# EAGLE design TTN-Node-v7-01 (EAGLE 9.4.2)

## Sheet 1 of 2
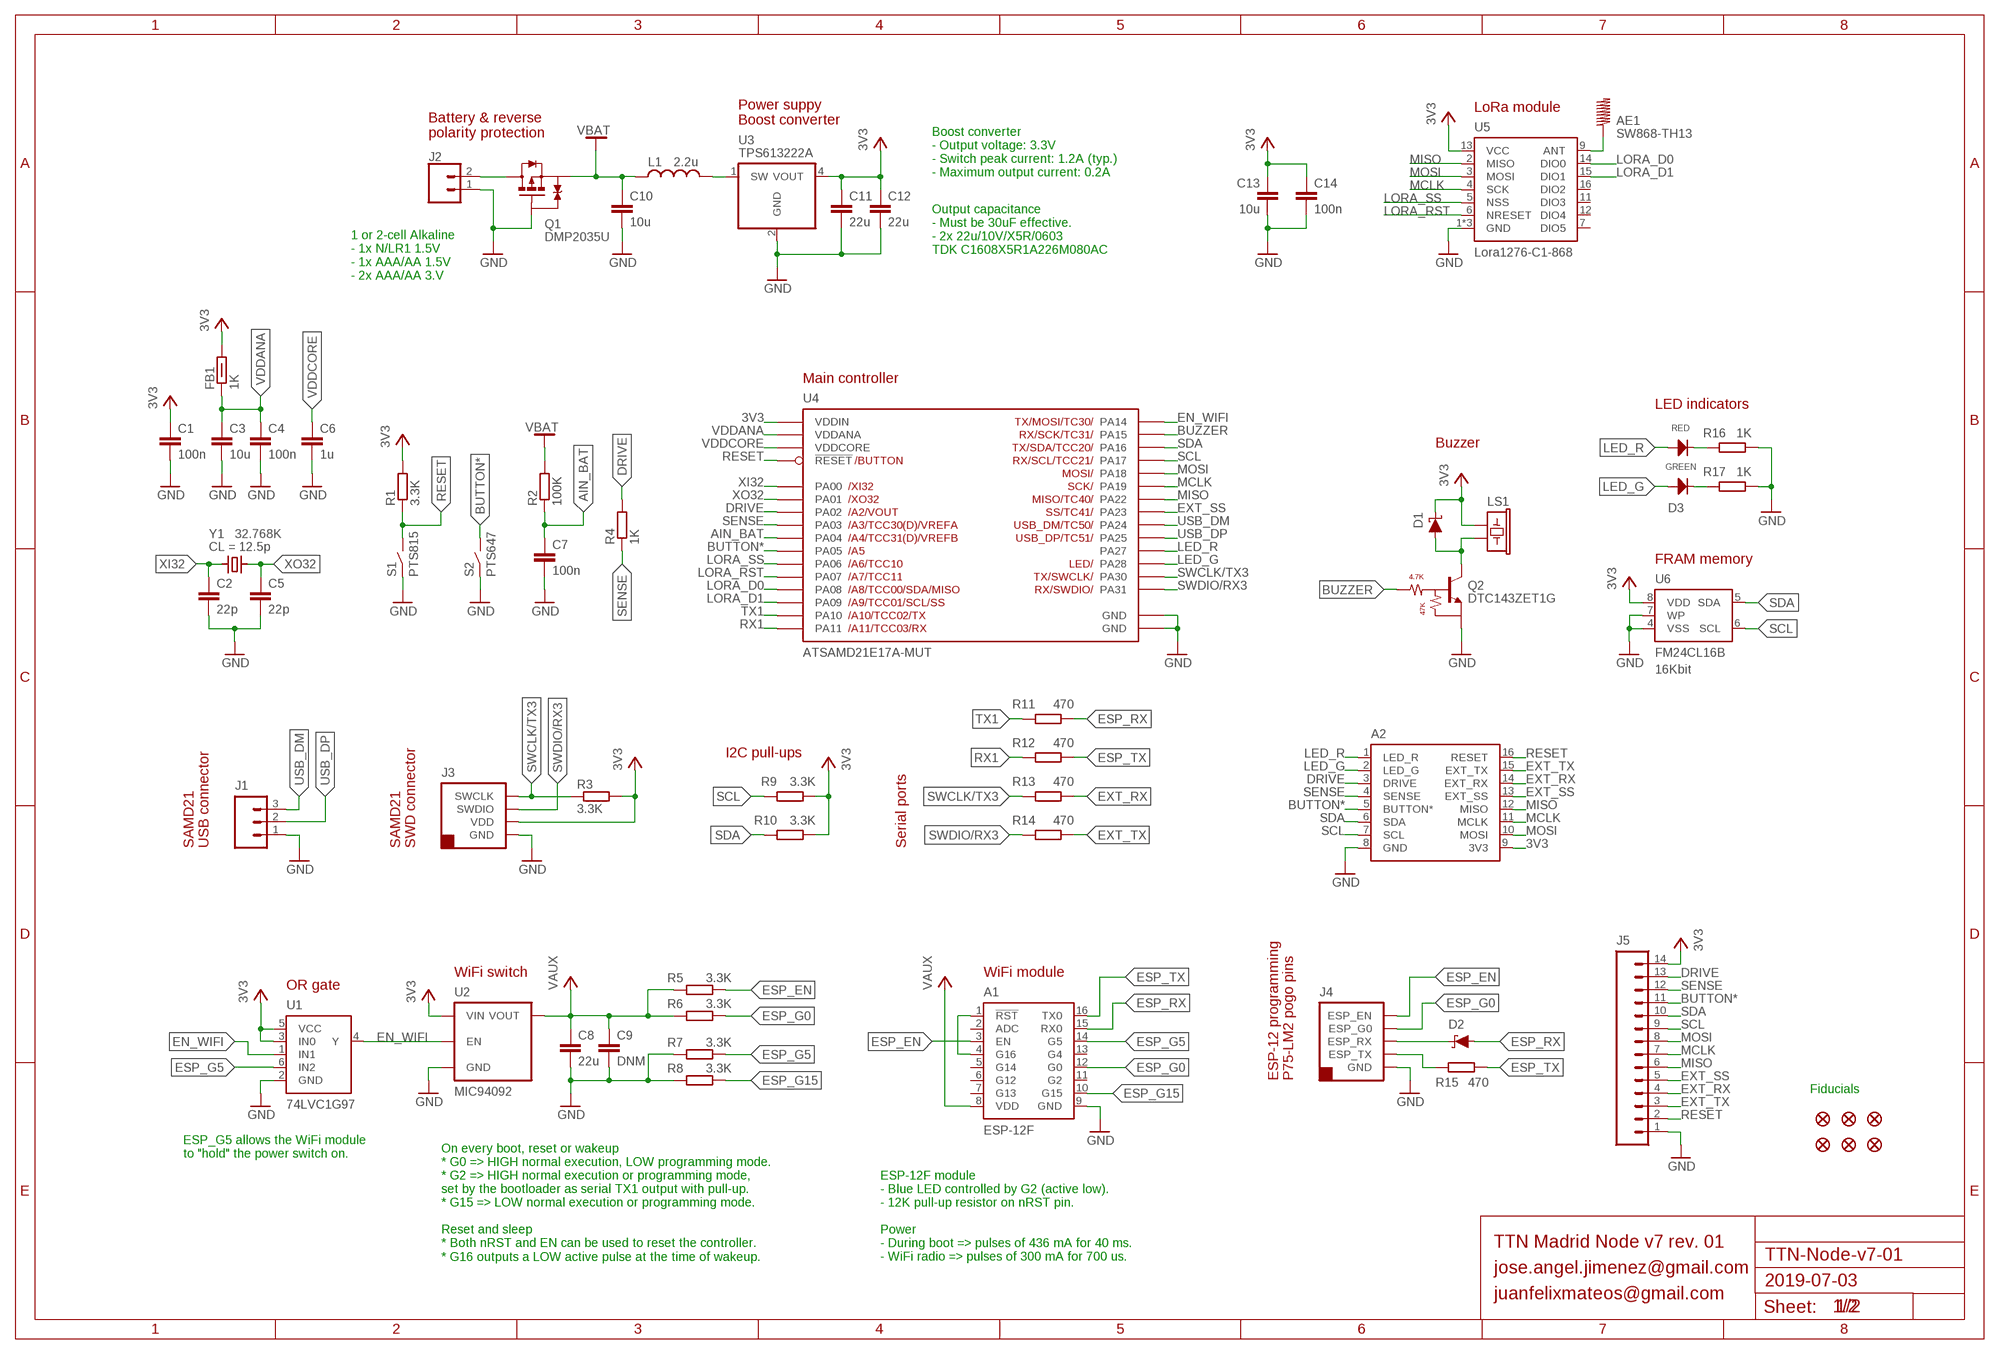
[diagram p0: schematic, sheet 1]

### Parts
A1  ESP-12F  [ESP-12]
A2  TTN_MAD_NODE_V7_EXP  [TTN_MAD_NODE_V7_EXP]
AE1  SW868-TH13  ANT-SW868-TH13  [ANT-SW868-TH13]
C1  100n  CAPACITOR_0603  [C0603]
C2  22p  CAPACITOR_0603  [C0603]
C3  10u  CAPACITOR_0603  [C0603]
C4  100n  CAPACITOR_0603  [C0603]
C5  22p  CAPACITOR_0603  [C0603]
C6  1u  CAPACITOR_0603  [C0603]
C7  100n  CAPACITOR_0603  [C0603]
C8  22u  CAPACITOR_0603  [C0603]
C9  DNM  CAPACITOR_0603  [C0603]
C10  10u  CAPACITOR_0603  [C0603]
C11  22u  CAPACITOR_0603  [C0603]
C12  22u  CAPACITOR_0603  [C0603]
C13  10u  CAPACITOR_0603  [C0603]
C14  100n  CAPACITOR_0603  [C0603]
D1  RB521S30  DIODE-SCHOTTKY-RB521S30T1G  [SOD523]
D2  RB521S30  DIODE-SCHOTTKY-RB521S30T1G  [SOD523]
D3  LTST-E682KRKGWT  LED-RG-LTST-E682KRKGWT  [LED-PLCC-4-3522]
FB1  1K  FERRITE_BEAD_0603_1K  [L0603]
FD1  FIDUCIAL1X2  [FIDUCIAL-1X2]
FD2  FIDUCIAL1X2  [FIDUCIAL-1X2]
FD3  FIDUCIAL1X2  [FIDUCIAL-1X2]
FD4  FIDUCIAL1X2  [FIDUCIAL-1X2]
FD5  FIDUCIAL1X2  [FIDUCIAL-1X2]
FD6  FIDUCIAL1X2  [FIDUCIAL-1X2]
J1  USB  CONN_03  [1X03]
J2  CONN_02  [1X02]
J3  CON-SWD-HDR-1X4-254  [HDR-1X4-254-SWD]
J4  CON-ESP-HDR-1X5-254  [HDR-1X5-254-ESP]
J5  CONN_14  [1X14]
L1  2.2u  INDUCTOR_2520_MM  [L2520_MM]
LS1  BUZZER-SMD-4030_MM  [BUZZER-4030_MM]
Q1  DMP2035U  MOSFET-P-DMP2035U-ESD  [SOT23-3]
Q2  DTC143ZET1G  BJT-NPN-4.7K-47K  [SC75-3]
R1  3.3K  RESISTOR_0603  [R0603]
R2  100K  RESISTOR_0603  [R0603]
R3  3.3K  RESISTOR_0603  [R0603]
R4  1K  RESISTOR_0603  [R0603]
R5  3.3K  RESISTOR_0603  [R0603]
R6  3.3K  RESISTOR_0603  [R0603]
R7  3.3K  RESISTOR_0603  [R0603]
R8  3.3K  RESISTOR_0603  [R0603]
R9  3.3K  RESISTOR_0603  [R0603]
R10  3.3K  RESISTOR_0603  [R0603]
R11  470  RESISTOR_0603  [R0603]
R12  470  RESISTOR_0603  [R0603]
R13  470  RESISTOR_0603  [R0603]
R14  470  RESISTOR_0603  [R0603]
R15  470  RESISTOR_0603  [R0603]
R16  1K  RESISTOR_0603  [R0603]
R17  1K  RESISTOR_0603  [R0603]
S1  PTS815  SW-PTS810/815-PTS815  [SW-SMD-PTS815-4232]
S2  PTS647  SW-PTS647-2.5N-5.0MM  [SW-SMD-PTS647-4545]
U1  74LVC1G97  LOGIC-1G97DCKR  [SC70-6]
U2  MIC94092  MIC94092YC6-TR  [SOT363]
U3  TPS613222A  VREG-TPS613222ADBVR  [SOT23-5]
U4  ATSAMD21E17A-MUT  SAMD21E_A/B/C/D-QFN32L  [VQFN32L-05-5050_MM-SEGMENTED]
U5  Lora1276-C1-868  LORA-RFM95W-LORA1276-C1-868  [RFM95W]
U6  FM24CL16B  MEMORY-I2C-WP-FM24CL16B-G  [SO8]
Y1  32.768K  CRYSTAL-3215  [CRYSTAL-3215]

### Nets
3V3 [supply]: A2.9(3V3) C1.P$1 C11.P$1 C12.P$1 C13.P$1 C14.P$1 D1.C FB1.P$2 J3.2(VDD) J5.14 LS1.1 R1.P$2 R3.P$2 R9.P$2 R10.P$2 U1.3(IN0) U1.5(VCC) U2.4(VIN) U3.4(VOUT) U4.30(VDDIN) U5.13(VCC) U6.8(VDD) ; also sheet 2
*ESP_RST: A1.1(!RST) A1.4(G16)
AIN_BAT: C7.P$1 R2.P$1 U4.5(PA04)
ANT [supply]: AE1.ANT U5.9(ANT)
BOOST_SW [supply]: L1.2 U3.1(SW)
BUTTON*: A2.5(BUTTON*) J5.11 S2.3 S2.4 U4.6(PA05)
BUZZER: Q2.1(B) U4.16(PA15)
CG: D3.3(C_GREEN) R17.P$1
CR: D3.1(C_RED) R16.P$1
DRIVE: A2.3(DRIVE) J5.13 R4.P$2 U4.3(PA02)
EN_WIFI: U1.1(IN1) U1.4(Y) U2.6(EN) U4.15(PA14)
ESP_EN: A1.3(EN) J4.5(ESP_EN) R5.P$2
ESP_G0: A1.12(G0) J4.4(ESP_G0) R6.P$2
ESP_G5: A1.14(G5) R7.P$2 U1.6(IN2)
ESP_G15: A1.10(G15) R8.P$2
ESP_RX: A1.15(RX0) D2.A R11.P$2
ESP_RX_CON: D2.C J4.3(ESP_RX)
ESP_TX: A1.16(TX0) R12.P$2 R15.P$2
ESP_TX_CON: J4.2(ESP_TX) R15.P$1
EXT_RX: A2.14(EXT_RX) J5.4 R13.P$2
EXT_SS: A2.13(EXT_SS) J5.5 U4.22(PA23)
EXT_TX: A2.15(EXT_TX) J5.3 R14.P$2
GND [supply]: A1.9(GND) A2.8(GND) C1.P$2 C2.P$2 C3.P$2 C4.P$2 C5.P$2 C6.P$2 C7.P$2 C8.P$2 C9.P$2 C10.P$2 C11.P$2 C12.P$2 C13.P$2 C14.P$2 J1.1 J2.1 J3.1(GND) J4.1(GND) J5.1 Q1.1(G) Q2.2(E) R7.P$1 R8.P$1 R16.P$2 R17.P$2 S1.1 S1.2 S2.1 S2.2 U1.2(GND) U2.2(GND) U2.5(GND) U3.2(GND) U4.10(GND) U4.28(GND) U4.33(GND) U5.1(GND) U5.8(GND) U5.10(GND) U6.4(VSS) U6.7(WP) ; also sheet 2
LED_G: A2.2(LED_G) D3.2(A_GREEN) U4.27(PA28)
LED_R: A2.1(LED_R) D3.4(A_RED) U4.25(PA27)
LORA_D0: U4.11(PA08) U5.14(DIO0)
LORA_D1: U4.12(PA09) U5.15(DIO1)
LORA_RST: U4.8(PA07) U5.6(NRESET)
LORA_SS: U4.7(PA06) U5.5(NSS)
MCLK: A2.11(MCLK) J5.7 U4.20(PA19) U5.4(SCK)
MISO: A2.12(MISO) J5.6 U4.21(PA22) U5.2(MISO)
MOSI: A2.10(MOSI) J5.8 U4.19(PA18) U5.3(MOSI)
N$1: D1.A LS1.2 Q2.3(C)
RESET: A2.16(RESET) J5.2 R1.P$1 S1.3 S1.4 U4.26(!RESET)
RX1: R12.P$1 U4.14(PA11)
SCL: A2.7(SCL) J5.9 R9.P$1 U4.18(PA17) U6.6(SCL) ; also sheet 2
SDA: A2.6(SDA) J5.10 R10.P$1 U4.17(PA16) U6.5(SDA) ; also sheet 2
SENSE: A2.4(SENSE) J5.12 R4.P$1 U4.4(PA03)
SWCLK/TX3: J3.4(SWCLK) R3.P$1 R13.P$1 U4.31(PA30)
SWDIO/RX3: J3.3(SWDIO) R14.P$1 U4.32(PA31) ; also sheet 2
TX1: R11.P$1 U4.13(PA10)
USB_DM: J1.3 U4.23(PA24)
USB_DP: J1.2 U4.24(PA25)
VAUX [supply]: A1.8(VDD) C8.P$1 C9.P$1 R5.P$1 R6.P$1 U2.1(VOUT)
VBAT [supply]: C10.P$1 L1.1 Q1.2(S) R2.P$2
VDDANA [supply]: C3.P$1 C4.P$1 FB1.P$1 U4.9(VDDANA)
VDDCORE [supply]: C6.P$1 U4.29(VDDCORE)
VIN [supply]: J2.2 Q1.3(D)
XI32 [supply]: C2.P$1 U4.1(PA00) Y1.P$1
XO32 [supply]: C5.P$1 U4.2(PA01) Y1.P$2
Unconnected: A1.2(ADC) A1.5(G14) A1.6(G12) A1.7(G13) A1.11(G2) A1.13(G4) U5.7(DIO5) U5.11(DIO3) U5.12(DIO4) U5.16(DIO2)

### Notes on the sheet
- LoRa module
- Power suppy
  Boost converter
- Battery & reverse
  polarity protection
- Boost converter
  - Output voltage: 3.3V
  - Switch peak current: 1.2A (typ.)
  - Maximum output current: 0.2A
- Output capacitance
  - Must be 30uF effective.
  - 2x 22u/10V/X5R/0603
  TDK C1608X5R1A226M080AC
- 1 or 2-cell Alkaline
  - 1x N/LR1 1.5V
  - 1x AAA/AA 1.5V
  - 2x AAA/AA 3.V
- Main controller
- LED indicators
- Buzzer
- FRAM memory
- I2C pull-ups
- SAMD21
  USB connector
- SAMD21
  SWD connector
- Serial ports
- WiFi switch | WiFi module
- OR gate
- ESP-12 programming
  P75-LM2 pogo pins
- Fiducials
- ESP_G5 allows the WiFi module
  to "hold" the power switch on.
- TTN Madrid Node v7 rev. 01
- On every boot, reset or wakeup
  * G0 => HIGH normal execution, LOW programming mode.
  * G2 => HIGH normal execution or programming mode,
  set by the bootloader as serial TX1 output with pull-up.
  * G15 => LOW normal execution or programming mode.
  
  Reset and sleep
  * Both nRST and EN can be used to reset the controller.
  * G16 outputs a LOW active pulse at the time of wakeup.
- ESP-12F module
  - Blue LED controlled by G2 (active low).
  - 12K pull-up resistor on nRST pin.
  
  Power
  - During boot => pulses of 436 mA for 40 ms.
  - WiFi radio => pulses of 300 mA for 700 us.
- jose.angel.jimenez@gmail.com
- 2019-07-03
- juanfelixmateos@gmail.com
- 1/2

## Sheet 2 of 2
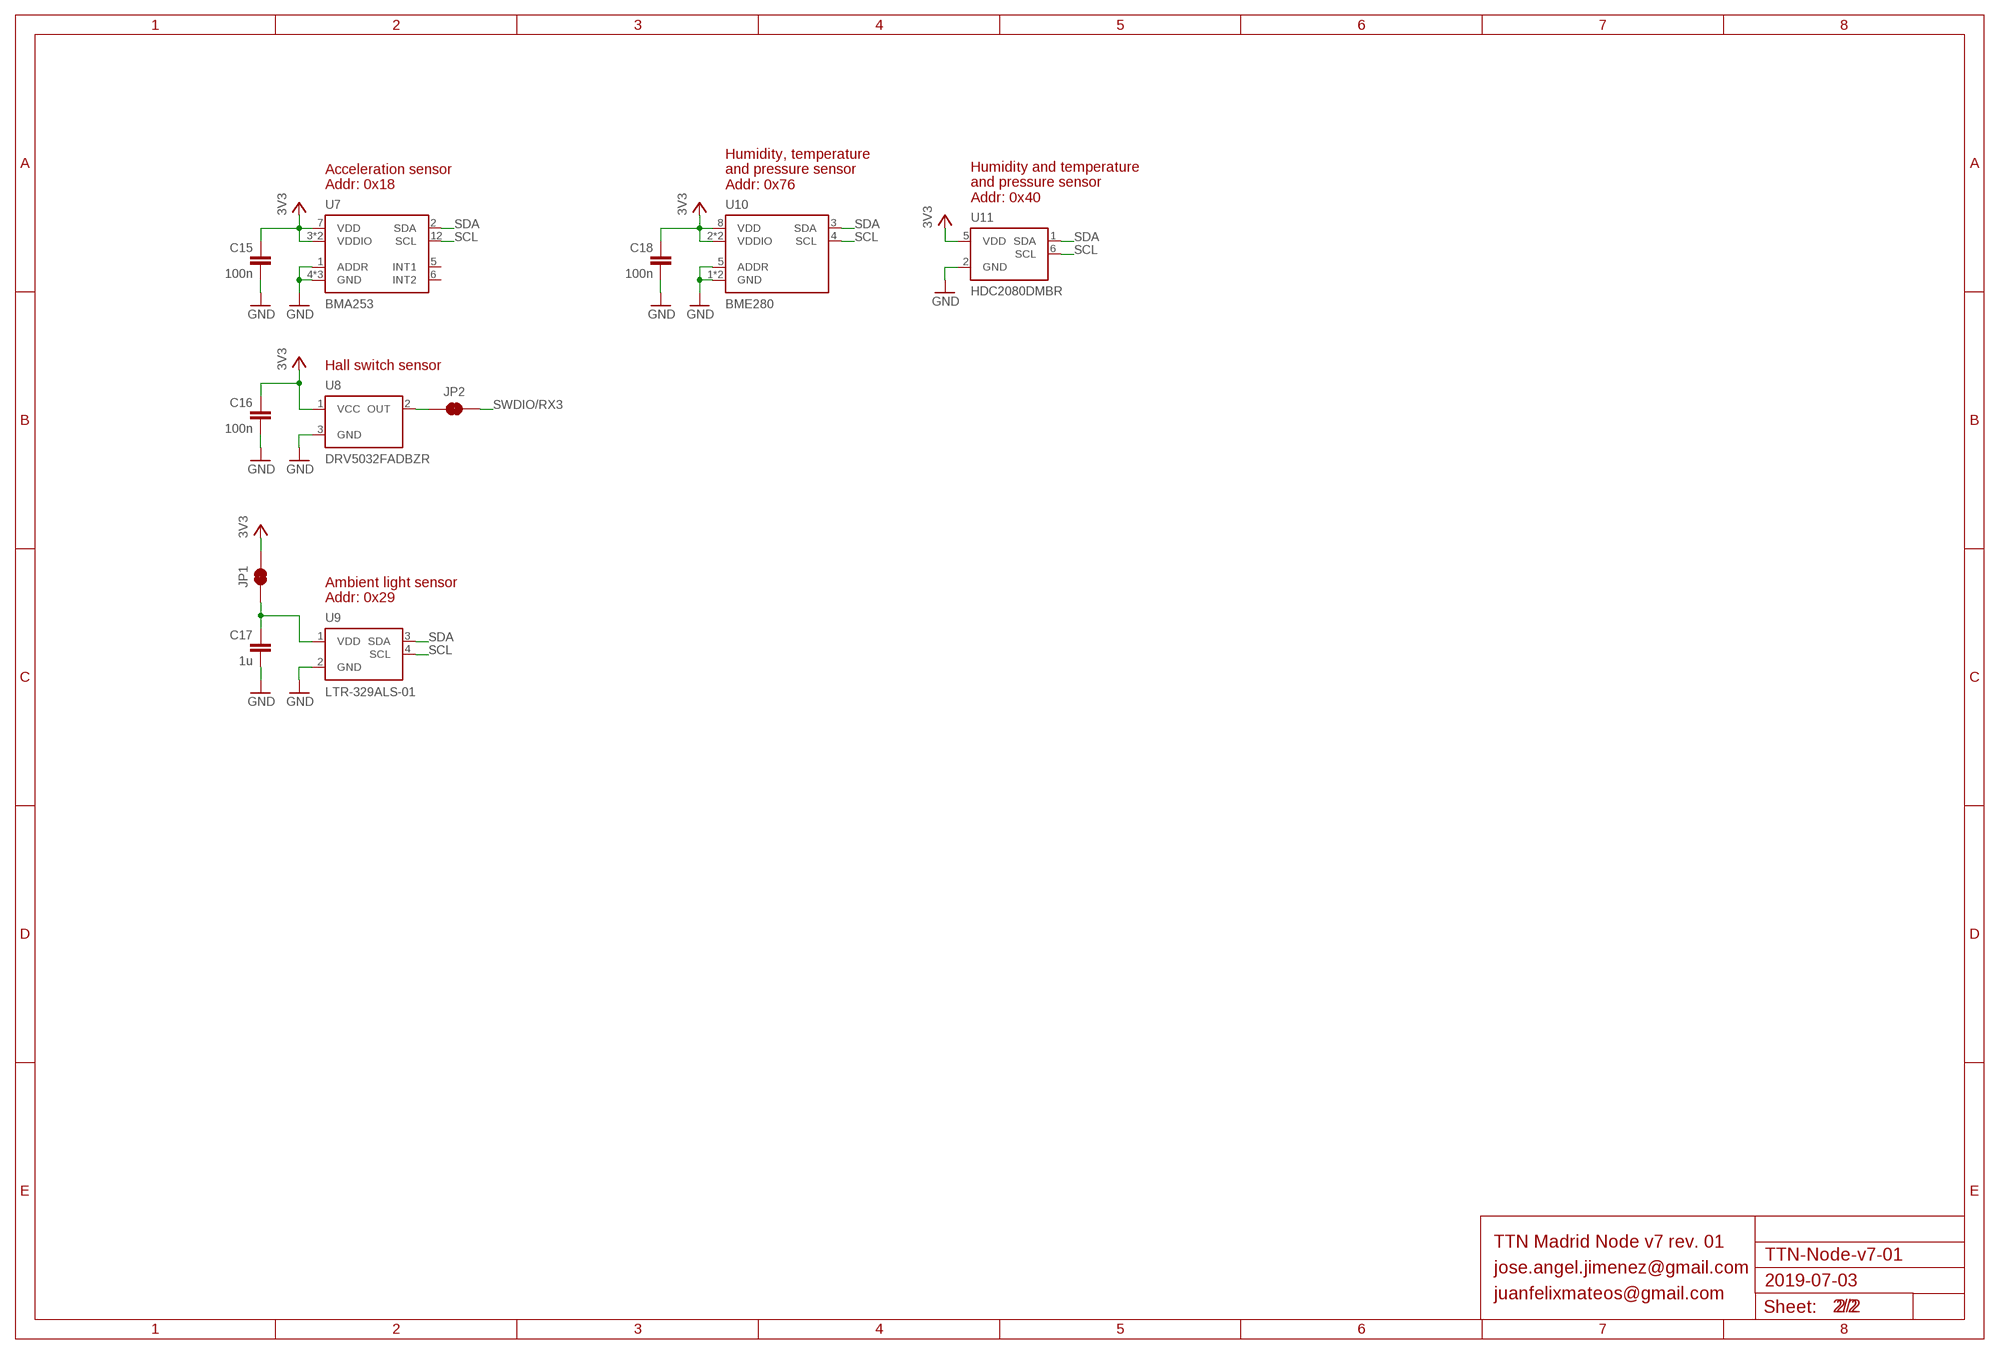
[diagram p1: schematic, sheet 2]

### Parts
C15  100n  CAPACITOR_0603  [C0603]
C16  100n  CAPACITOR_0603  [C0603]
C17  1u  CAPACITOR_0603  [C0603]
C18  100n  CAPACITOR_0603  [C0603]
JP1  JUMPER-SMT_2_NC_TRACE-OUTLINE  [SMT-JUMPER_2_NC_TRACE_OUTLINE]
JP2  JUMPER-SMT_2_NC_TRACE-OUTLINE  [SMT-JUMPER_2_NC_TRACE_OUTLINE]
U7  BMA253  SENSOR-BMA253-I2C  [LGA12]
U8  DRV5032FADBZR  SENSOR-DRV5032  [SOT23-3]
U9  LTR-329ALS-01  SENSOR-LTR-329ALS-01  [CHIPLED-PLCC4-2020MM]
U10  BME280  SENSOR-BME280-I2C  [BME280]
U11  HDC2080DMBR  SENSOR-HDC1080  [WSON-6-NOPAD]

### Nets
3V3 [supply]: C15.P$1 C16.P$1 C18.P$1 JP1.2 U7.3(VDDIO) U7.7(VDD) U7.11(VDDIO) U8.1(VCC) U10.2(VDDIO) U10.6(VDDIO) U10.8(VDD) U11.5(VDD) ; also sheet 1
GND [supply]: C15.P$2 C16.P$2 C17.P$2 C18.P$2 U7.1(ADDR) U7.4(GND) U7.8(GND) U7.9(GND) U8.3(GND) U9.2(GND) U10.1(GND) U10.5(ADDR) U10.7(GND) U11.2(GND) ; also sheet 1
LTR_3V3 [supply]: C17.P$1 JP1.1 U9.1(VDD)
N$2: JP2.1 U8.2(OUT)
SCL: U7.12(SCL) U9.4(SCL) U10.4(SCL) U11.6(SCL) ; also sheet 1
SDA: U7.2(SDA) U9.3(SDA) U10.3(SDA) U11.1(SDA) ; also sheet 1
SWDIO/RX3: JP2.2 ; also sheet 1
Unconnected: U7.5(INT1) U7.6(INT2)

### Notes on the sheet
- Acceleration sensor
  Addr: 0x18
- Humidity, temperature
  and pressure sensor
  Addr: 0x76
- Humidity and temperature
  and pressure sensor
  Addr: 0x40
- Hall switch sensor
- Ambient light sensor
  Addr: 0x29
- TTN Madrid Node v7 rev. 01
- jose.angel.jimenez@gmail.com
- 2019-07-03
- juanfelixmateos@gmail.com
- 2/2

## Library data of the parts
A1 = Anneo-Eagle:ESP-12: ESP-12 WiFi module, based on the ESP8266
A2 = Anneo-Connectors:TTN_MAD_NODE_V7_EXP: The Things Network Madrid Node v7 - 16-Pin Expansion Connector
AE1 = Anneo-Eagle:ANT-SW868-TH13: NiceRF SW868-TH13 copper spring antenna https://www.nicerf.com/product_143_118.html; MFR: NiceRF; MPN: SW868-TH13; POPULATE: 1
C1 C4 C7 C14-C16 C18 = Anneo-Eagle:CAPACITOR: Non-Polarized Capacitor. Manufacture part number (MPN) can be added via Attributes. Check https://factory.macrofab.com/parts for the house parts list. History 2019-02-09 - JAJV - Changed symbol to EU capacitor.; DIELECTRIC: X7R; MFR: Yageo; MPN: CC0603KRX7R9BB104; POPULATE: 1; SUPPLIER1: Mouser; TOLERANCE: 10%; VOLTAGE: 50V
C2 C5 = Anneo-Eagle:CAPACITOR: Non-Polarized Capacitor. Manufacture part number (MPN) can be added via Attributes. Check https://factory.macrofab.com/parts for the house parts list. History 2019-02-09 - JAJV - Changed symbol to EU capacitor.; DIELECTRIC: C0G; MFR: AVX; MPN: 06035A220JAT2A; POPULATE: 1; SUPPLIER1: Mouser; TOLERANCE: 5%; VOLTAGE: 50V
C3 C10 C13 = Anneo-Eagle:CAPACITOR: Non-Polarized Capacitor. Manufacture part number (MPN) can be added via Attributes. Check https://factory.macrofab.com/parts for the house parts list. History 2019-02-09 - JAJV - Changed symbol to EU capacitor.; DIELECTRIC: X5R; MFR: Murata; MPN: GRM188R60J106KE47D; POPULATE: 1; SUPPLIER1: Mouser; TOLERANCE: 10%; VOLTAGE: 6.3V
C6 C17 = Anneo-Eagle:CAPACITOR: Non-Polarized Capacitor. Manufacture part number (MPN) can be added via Attributes. Check https://factory.macrofab.com/parts for the house parts list. History 2019-02-09 - JAJV - Changed symbol to EU capacitor.; DIELECTRIC: X5R; MFR: Yageo; MPN: CC0603KRX5R8BB105; POPULATE: 1; SUPPLIER1: Mouser; TOLERANCE: 10%; VOLTAGE: 25V
C8 C11 C12 = Anneo-Eagle:CAPACITOR: Non-Polarized Capacitor. Manufacture part number (MPN) can be added via Attributes. Check https://factory.macrofab.com/parts for the house parts list. History 2019-02-09 - JAJV - Changed symbol to EU capacitor.; DIELECTRIC: X5R; MFR: TDK; MPN: C1608X5R1A226M080AC; POPULATE: 1; SUPPLIER1: Mouser; TOLERANCE: 20%; VOLTAGE: 10V
C9 = Anneo-Eagle:CAPACITOR: Non-Polarized Capacitor. Manufacture part number (MPN) can be added via Attributes. Check https://factory.macrofab.com/parts for the house parts list. History 2019-02-09 - JAJV - Changed symbol to EU capacitor.; DIELECTRIC: X5R; MFR: TDK; MPN: C1608X5R1A226M080AC; POPULATE: 0; SUPPLIER1: Mouser; TOLERANCE: 20%; VOLTAGE: 10V
D1 D2 = Anneo-Eagle:DIODE-SCHOTTKY; MFR: On Semi; MPN: RB521S30T1G; PN1: 863-RB521S30T1G; POPULATE: 1; SUPPLIER1: Mouser
D3 = Anneo-Eagle:LED-RG: Dual LED; MFR: Lite-On; MPN: LTST-E682KRKGWT; PN1: 859-LTST-E682KRKGWT; POPULATE: 1; SUPPLIER1: Mouser
FB1 = Anneo-Eagle:FERRITE_BEAD: Ferrite chip bead; MFR: TDK; MPN: MPZ1608S102ATA00; PN1: 810-MPZ1608S102ATA00; POPULATE: 1; SUPPLIER1: Mouser
FD1-FD6 = Anneo-Eagle:FIDUCIAL: Fiducial Alignment Points Point-of-reference for pick-and-place machines and other optical instruments.
J1 = SparkFun-Connectors:CONN_03: Multi connection point. Often used as Generic Header-pin footprint for 0.1 inch spaced/style header connections On any of the 0.1 inch spaced packages, you can populate with these: Break Away Headers - Straight <https://www.sparkfun.com/products/116> (PRT-00116) Break Away Male Headers - Right Angle <https://www.sparkfun.com/products/553> (PRT-00553) Female Headers <https://www.sparkfun.com/products/115> (PRT-00115) Break Away Headers - Machine Pin <https://www.sparkfun.com/products/117> (PRT-00117) Break Away Female Headers - Swiss Machine Pin <https://www.sparkfun.com/products/743> (PRT-00743) Stackable Header - 3 Pin (Female, 0.1") <https://www.sparkfun.com/products/13875> (PRT-13875) For SCREWTERMINALS and SPRING TERMINALS visit here: Screw Terimnals on SparkFun.com <https://www.sparkfun.com/search/results?term=Screw+Terminals> (5mm/3.5mm/2.54mm spacing) This device is also useful as a general connection point to wire up your design to another part of your project. Our various solder wires solder well into these plated through hole pads. Hook-Up Wire - Assortment (Stranded, 22 AWG) <https://www.sparkfun.com/products/11375> (PRT-11375) Hook-Up Wire - Assortment (Solid Core, 22 AWG) <https://www.sparkfun.com/products/11367> (PRT-11367) View the entire wire category on our website here <https://www.sparkfun.com/categories/141> Special notes: Molex polarized connector foot print use with SKU : PRT-08232 with associated crimp pins and housings.
J2 = SparkFun-Connectors:CONN_02: Multi connection point. Often used as Generic Header-pin footprint for 0.1 inch spaced/style header connections On any of the 0.1 inch spaced packages, you can populate with these: Break Away Headers - Straight <https://www.sparkfun.com/products/116> (PRT-00116) Break Away Male Headers - Right Angle <https://www.sparkfun.com/products/553> (PRT-00553) Female Headers <https://www.sparkfun.com/products/115> (PRT-00115) Break Away Headers - Machine Pin <https://www.sparkfun.com/products/117> (PRT-00117) Break Away Female Headers - Swiss Machine Pin <https://www.sparkfun.com/products/743> (PRT-00743) For SCREWTERMINALS and SPRING TERMINALS visit here: Screw Terimnals on SparkFun.com <https://www.sparkfun.com/search/results?term=Screw+Terminals> (5mm/3.5mm/2.54mm spacing) This device is also useful as a general connection point to wire up your design to another part of your project. Our various solder wires solder well into these plated through hole pads. Hook-Up Wire - Assortment (Stranded, 22 AWG) <https://www.sparkfun.com/products/11375> (PRT-11375) Hook-Up Wire - Assortment (Solid Core, 22 AWG) <https://www.sparkfun.com/products/11367> (PRT-11367) View the entire wire category on our website here <https://www.sparkfun.com/categories/141> Special notes: Molex polarized connector foot print use with: PRT-08233 with associated crimp pins and housings. 2.54_SCREWTERM for use with PRT-10571. 3.5mm Screw Terminal footprints for PRT-08084 5mm Screw Terminal footprints for use with PRT-08432
J3 = Anneo-Eagle:CON-SWD-HDR-1X4-254: SWD programming header, pitch 2.54mm
J4 = Anneo-Eagle:CON-ESP-HDR-1X5-254: ESP8266 programming header
J5 = Anneo-Connectors:CONN_14: Multi connection point. Often used as Generic Header-pin footprint for 0.1 inch spaced/style header connections On any of the 0.1 inch spaced packages, you can populate with these: Break Away Headers - Straight <https://www.sparkfun.com/products/116> (PRT-00116) Break Away Male Headers - Right Angle <https://www.sparkfun.com/products/553> (PRT-00553) Female Headers <https://www.sparkfun.com/products/115> (PRT-00115) Break Away Headers - Machine Pin <https://www.sparkfun.com/products/117> (PRT-00117) Break Away Female Headers - Swiss Machine Pin <https://www.sparkfun.com/products/743> (PRT-00743) For SCREWTERMINALS and SPRING TERMINALS visit here: Screw Terimnals on SparkFun.com <https://www.sparkfun.com/search/results?term=Screw+Terminals> (5mm/3.5mm/2.54mm spacing) This device is also useful as a general connection point to wire up your design to another part of your project. Our various solder wires solder well into these plated through hole pads. Hook-Up Wire - Assortment (Stranded, 22 AWG) <https://www.sparkfun.com/products/11375> (PRT-11375) Hook-Up Wire - Assortment (Solid Core, 22 AWG) <https://www.sparkfun.com/products/11367> (PRT-11367) View the entire wire category on our website here <https://www.sparkfun.com/categories/141> Special notes: Molex polarized connector foot print use with SKU : PRT-08231 with associated crimp pins and housings. 1MM SMD Version SKU: PRT-10208 NOTES ON THE VARIANTS LOCK and LOCK_LONGPADS... This footprint was designed to help hold the alignment of a through-hole component (i.e. 6-pin header) while soldering it into place. You may notice that each hole has been shifted either up or down by 0.005 of an inch from it's more standard position (which is a perfectly straight line). This slight alteration caused the pins (the squares in the middle) to touch the edges of the holes. Because they are alternating, it causes a "brace" to hold the component in place. 0.005 has proven to be the perfect amount of "off-center" position when using our standard breakaway headers. Although looks a little odd when you look at the bare footprint, once you have a header in there, the alteration is very hard to notice. Also,if you push a header all the way into place, it is covered up entirely on the bottom side.
JP1 JP2 = Anneo-Eagle:JUMPER-SMT_2_NC_TRACE: Normally closed trace jumper This jumper has a trace between two pads so it's normally closed (NC). Use a razor knife to open the connection. For best results follow the IPC guidelines for cutting traces: Cutout at least 0.063 mm (0.005 in). Remove all loose material to clean up the cut area. Seal the cut with an approved epoxy. Reapply solder to reclose the connection.
L1 = Anneo-Eagle:INDUCTOR: Inductor; MFR: Bourns; MPN: SRN2512-2R2M; PN1: 652-SRN2512-2R2M; POPULATE: 1; SUPPLIER1: Mouser
LS1 = Anneo-Eagle:BUZZER: Buzzer; MFR: AAC; MPN: DET402-G-1; POPULATE: 1
Q1 = Anneo-Eagle:MOSFET-P-DMP2035U-ESD; MFR: Diodes; MPN: DMP2035U-7; PN1: 621-DMP2035U-7; POPULATE: 1; SUPPLIER1: Mouser
Q2 = Anneo-Eagle:BJT-NPN-4.7K-47K: NPN Transistor with built-in base (RB) and base-emitter (RBE) resistors; MFR: On Semi; MPN: DTC143ZET1G; PN1: 863-DTC143ZET1G; POPULATE: 1; SUPPLIER1: Mouser
R1-R4 R9-R14 = Anneo-Eagle:RESISTOR: Resistor. Manufacture part number (MPN), Voltage, Tolerance, and Wattage Rating can be added via Attributes. Check https://factory.macrofab.com/parts for the house parts list. History 2019-02-09 - JAJV - Changed symbol to EU resistor.; POPULATE: 1; TOLERANCE: 1%
R5-R8 R15-R17 = Anneo-Eagle:RESISTOR: Resistor. Manufacture part number (MPN), Voltage, Tolerance, and Wattage Rating can be added via Attributes. Check https://factory.macrofab.com/parts for the house parts list. History 2019-02-09 - JAJV - Changed symbol to EU resistor.; POPULATE: 1
S1 = Anneo-Eagle:SW-PTS810/815: C&K Components PTS810/PTS815 switch - 4.2 x 3.2 mm footprint - 2.5 mm thickness; MFR: C&K; MPN: PTS815 SJM 250 SMTR LFS; PN1: 611-PTS815SJM250SMTR; POPULATE: 1; SUPPLIER1: Mouser
S2 = Anneo-Eagle:SW-PTS647: C&K PTS 647 Series Tactile Switch • 4.5 x 4.5 mm footprint • 3.8, 5.0 or 7.0 mm height; MFR: C&K; MPN: PTS647SK50SMTR2LFS; PN1: 611-PTS647SK50SMTR2L; POPULATE: 1; SUPPLIER1: Mouser
U1 = Anneo-Eagle:LOGIC-1G97: Texas Instruments SN74LVC1G97 - Configurable Multiple-Function Gate; MFR: TI; MPN: SN74LVC1G97DCKR; PN1: 595-SN74LVC1G97DCKR; POPULATE: 1; SUPPLIER1: Mouser
U2 = Anneo-Eagle:MIC94092: MIC94092 - High side load switch with soft start; MFR: Microchip; MPN: MIC94092YC6-TR; PN1: 998-MIC94092YC6TR; POPULATE: 1; SUPPLIER1: Mouser
U3 = Anneo-Eagle:VREG-TPS613222A: TPS61322 - 6.5-μA Quiescent current, 1.8-A switch current boost converter The AP2112 is CMOS process low dropout linear regulator with enable function, the regulator delivers a guaranteed 600mA (min.) continuous load current. Operating input voltage range: 0.9 V to 5.5 V Output voltage: 5.0 V 6.5-μA Quiescent current into VOUT pin ±3% Output voltage accuracy over temperature Minimum switch peak-current limit: – 1.10 A for TPS613222A Thermal shutdown protection; MFR: Texas Instruments; MPN: TPS613222ADBVR; PN1: 595-TPS613222ADBVR; POPULATE: 1; SUPPLIER1: Mouser
U4 = Anneo-Eagle:SAMD21E_A/B/C/D: SAM D21ExA/B/C/D
U5 = Anneo-Eagle:LORA-RFM95W: LoRa module; MFR: NiceRF; MPN: Lora1276-C1-868; POPULATE: 1
U6 = Anneo-Eagle:MEMORY-I2C-WP: I2C memory with Write Protect; MFR: Cypress; MPN: FM24CL16B-GTR; PN1: 877-FM24CL16B-GTR; POPULATE: 1; SIZE: 16Kbit; SUPPLIER1: Mouser
U7 = Anneo-Eagle:SENSOR-BMA253-I2C: BMA253 - I2C pinout Triaxial, low-g acceleration sensor with digital output.
U8 = Anneo-Eagle:SENSOR-DRV5032: Texas Instruments DRV5032 - Hall Effect Sensor Ultra-Low-Power Digital-Switch Hall Effect Sensor
U9 = Anneo-Eagle:SENSOR-LTR-329ALS-01: Lite-On LTR-329ALS-01 Ambient Light Photo Sensor with digital I2C interface, http://www.mouser.com/ds/2/239/liteon_LTR-329ALS-01-555525.pdf
U10 = Anneo-Eagle:SENSOR-BME280-I2C: DIGITAL HUMIDITY, PRESSURE AND TEMPERATURE SENSOR * Digital interface I²C (up to 3.4 MHz) and SPI (3 and 4 wire, up to 10 MHz)* Supply voltage VDD main supply voltage range: 1.71 V to 3.6 V*VDDIO interface voltage range: 1.2 V to 3.6 V Operating range -40…+85 °C, 0…100 % rel. humidity, 300…1100 hPa The library has been designed by Richard Magdycz <https://www.facebook.com/groups/eaglecadsoftUK>
U11 = Anneo-Eagle:SENSOR-HDC1080: HDC1080 Low Power, High Accuracy Digital Humidity Sensor with Temperature Sensor 6-WSON -40 to 125
Y1 = Anneo-Eagle:CRYSTAL: Crystal; CL: 12.5p; MFR: Epson; MPN: FC-135 32.7680KA-A3; PN1: 732-FC135-32.76KAA3; POPULATE: 1; SUPPLIER1: Mouser

## Net classes
0 default: width 0.15 mm, drill 0.3 mm, clearance 0.15 mm
1 supply: width 0.2 mm, drill 0.3 mm, clearance 0.15 mm

## Board
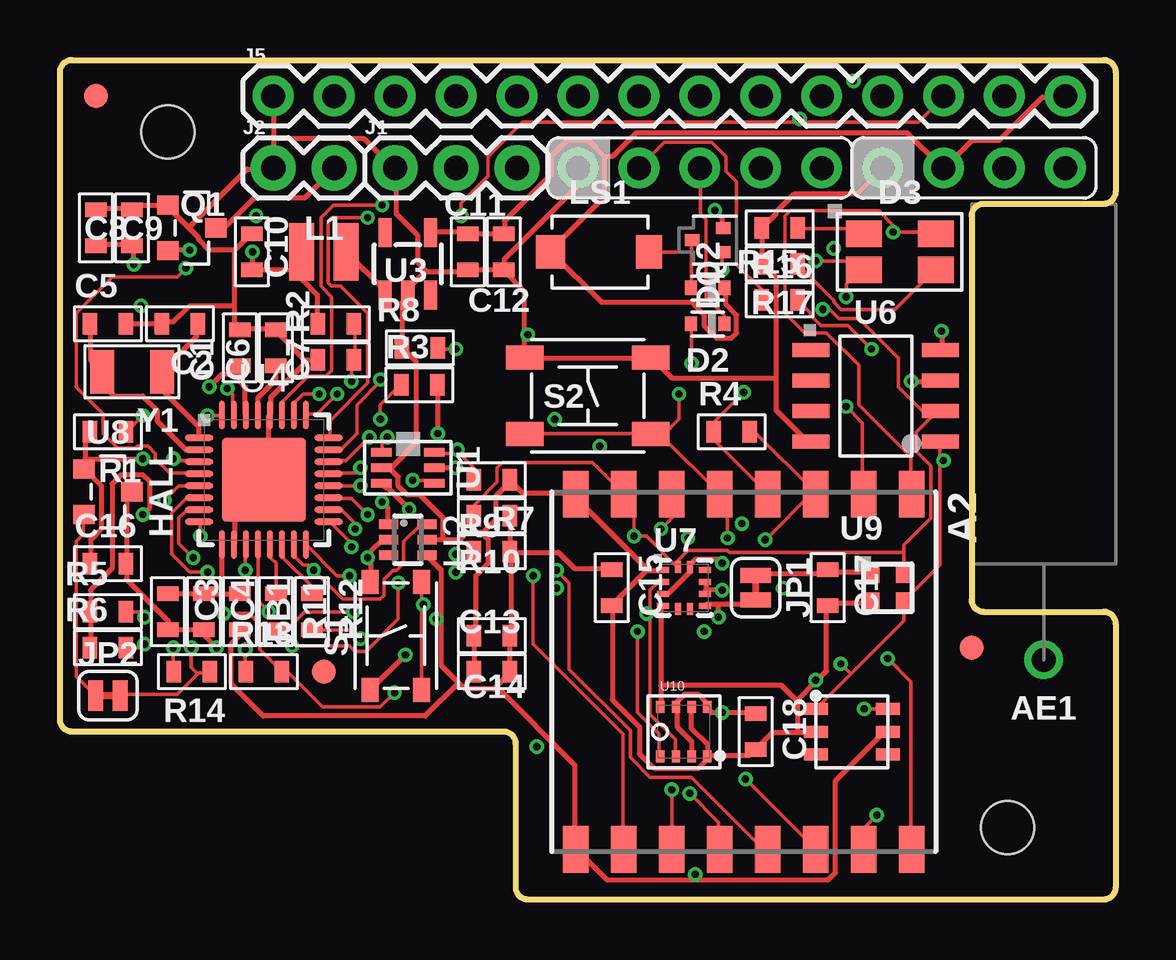
[diagram p2: board, top side]
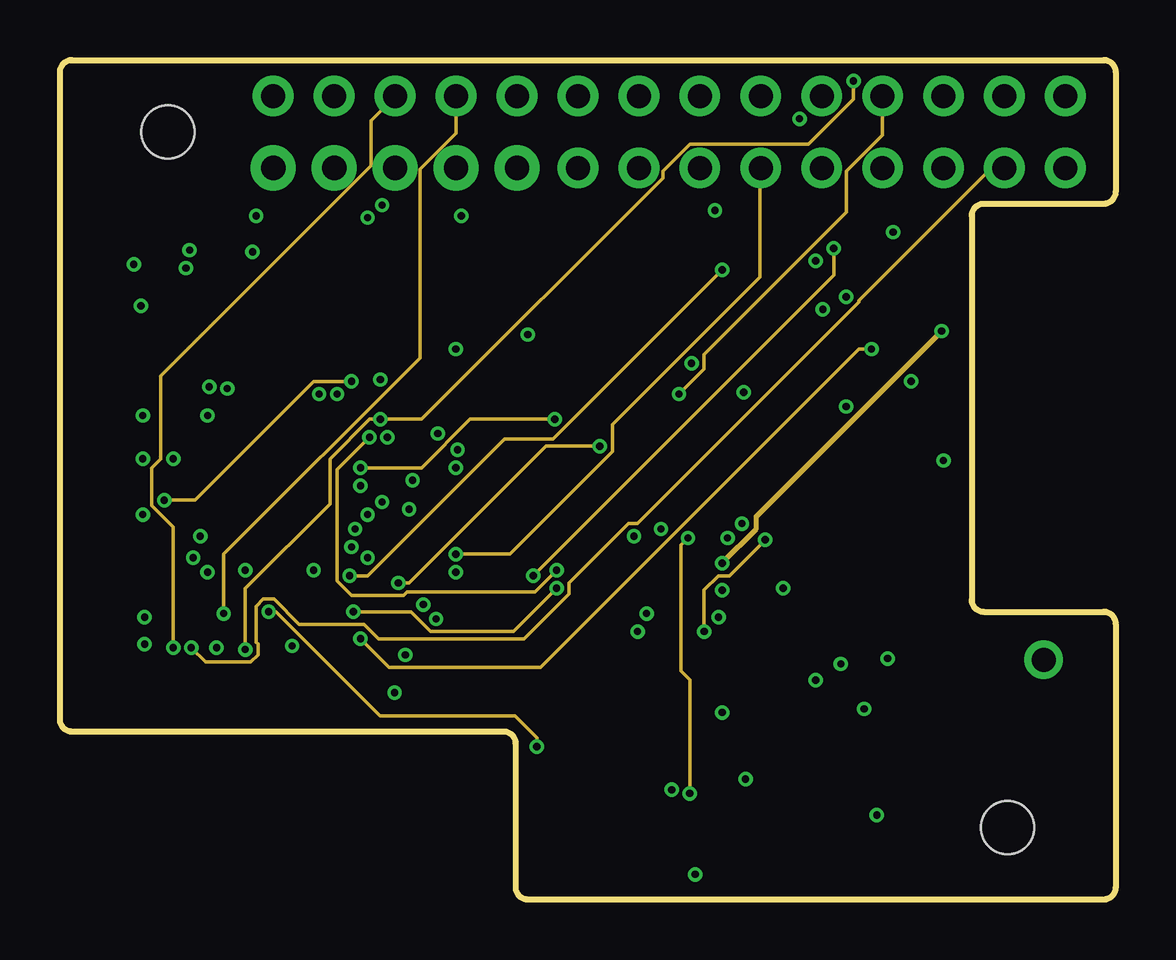
[diagram p3: board, inner layer Route2]
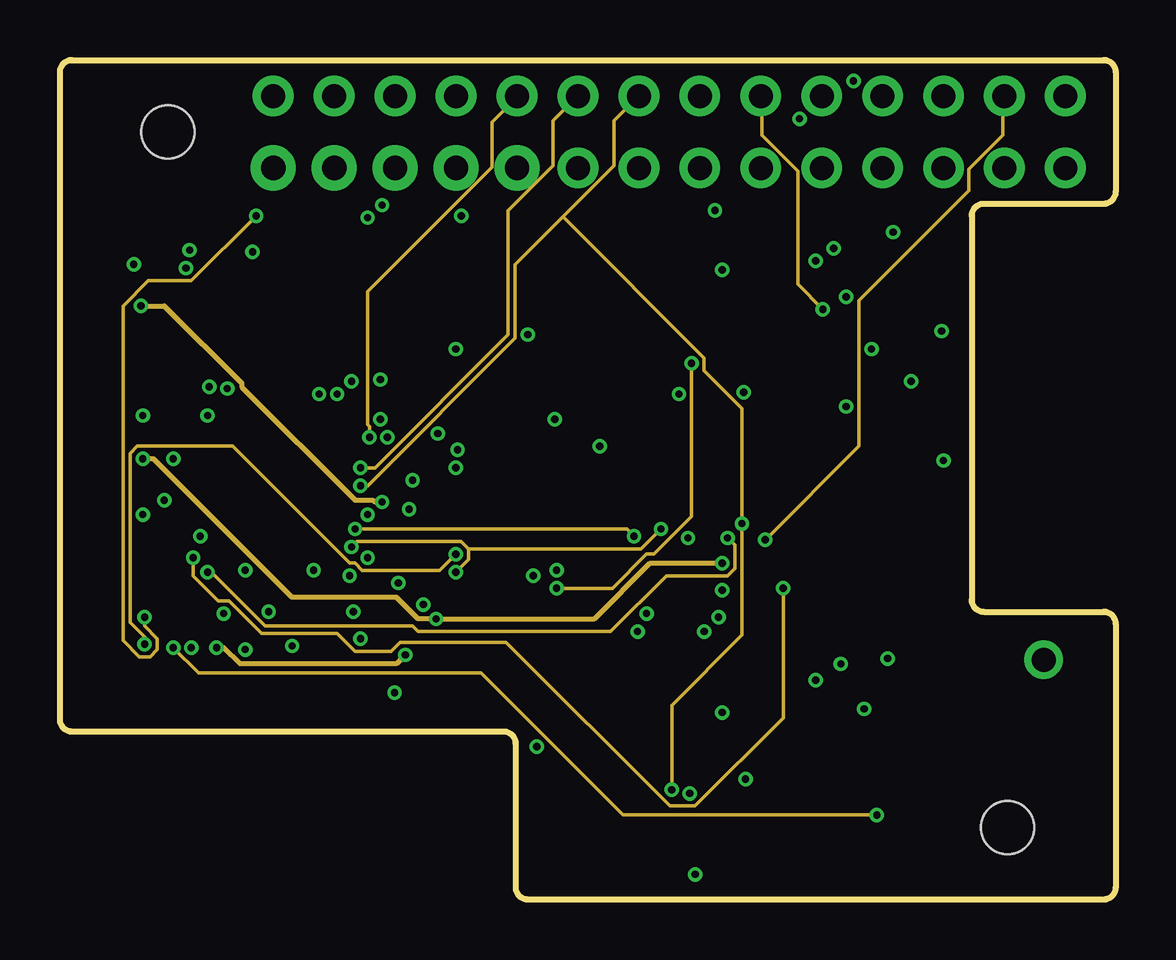
[diagram p4: board, inner layer Route15]
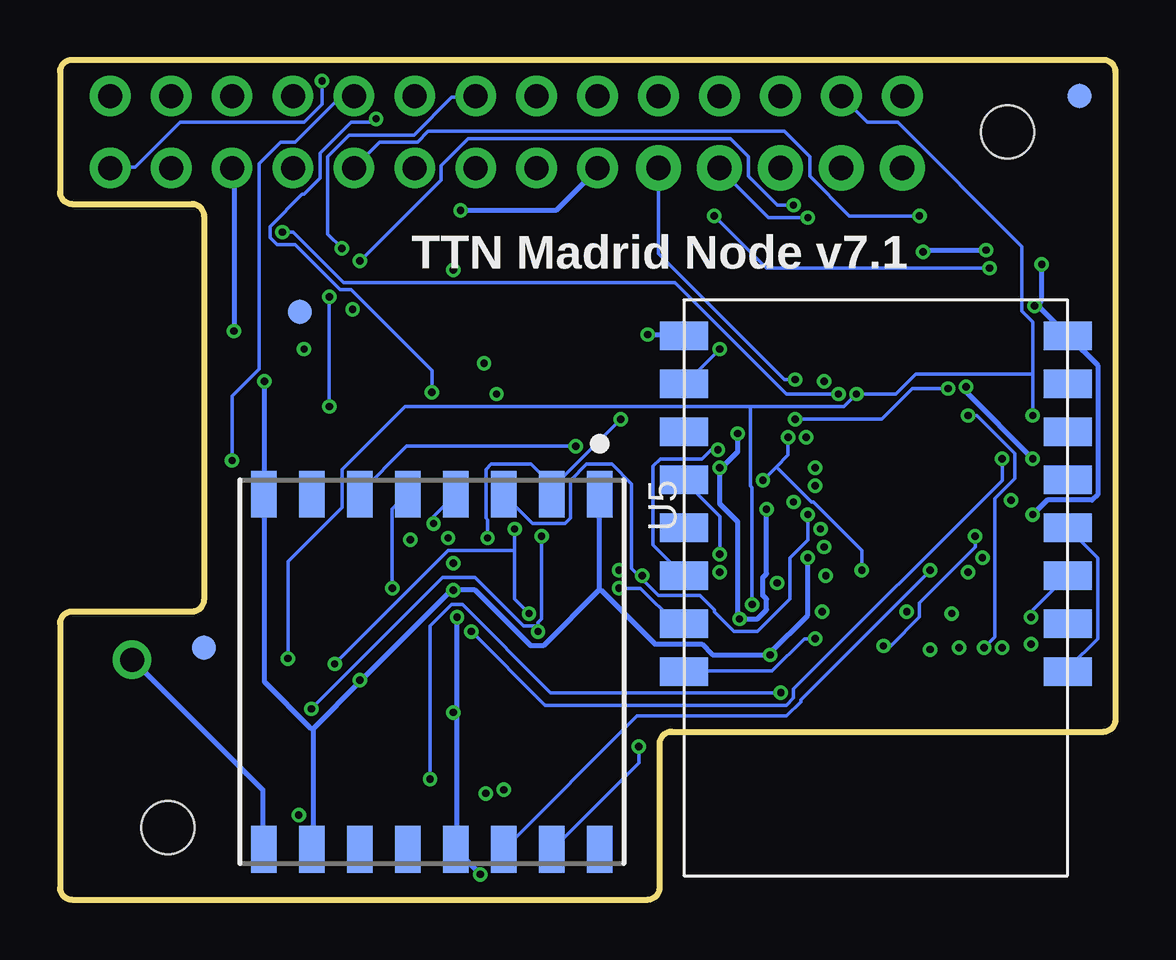
[diagram p5: board, bottom side, seen from below]

Size 44 x 35 mm. Coordinates in mm from the lower left corner, seen from the top.
Outline: 19.5,0 arc-90 19,0.5 19,6.5 arc90 18.5,7 0.5,7 arc-90 0,7.5 0,34.5 arc-90 0.5,35 43.5,35 arc-90 44,34.5 44,29.5 arc-90 43.5,29 38.5,29 arc90 38,28.5 38,12.5 arc90 38.5,12 43.5,12 arc-90 44,11.5 44,0.5 arc-90 43.5,0 19.5,0
Copper layers (1+2*15+16): Top 0.035mm / dielectric 0.2mm / Route2 0.0175mm / dielectric 1.065mm / Route15 0.0175mm / dielectric 0.2mm / Bottom 0.035mm
Design rules "Anneo-4layer-JLCPCB": minimum track width 5mil, minimum drill 0.2mm, track to track 5mil, track to pad 5mil, pad to pad 5mil, via to via 5mil, smd to smd 5mil, copper to edge 0.4mm, drill to drill 0.25mm, minimum pad ring 0.25mm, minimum via ring 0.15mm, stop-mask expansion 0.075mm, vias tented up to drill 0.35mm, thermal gap 0.25mm
Holes 2.2 mm at 4.5,32 39.5,3
tRestrict: area 37.2,0.7 to 41.8,5.3; area 2.2,29.7 to 6.8,34.3; area 3,32 to 6,35
bRestrict: area 3,32 to 6,35; area 2.2,29.7 to 6.8,34.3; area 37.2,0.7 to 41.8,5.3

### Footprints (pad centres in the part's own frame; a part is rotated, then mirrored left to right if it is on the bottom)
ESP-12 = smd 2 x 1.2: 1 -8,3.5; 2 -8,1.5; 3 -8,-0.5; 4 -8,-2.5; 5 -8,-4.5; 6 -8,-6.5; 7 -8,-8.5; 8 -8,-10.5; 9 8,-10.5; 10 8,-8.5; 11 8,-6.5; 12 8,-4.5; 13 8,-2.5; 14 8,-0.5; 15 8,1.5; 16 8,3.5
TTN_MAD_NODE_V7_EXP = smd 1.95 x 1.05: 1 -7.4,7; 2 -7.4,5; 3 -7.4,3; 4 -7.4,1; 5 -7.4,-1; 6 -7.4,-3; 7 -7.4,-5; 8 -7.4,-7; 9 7.4,-7; 10 7.4,-5; 11 7.4,-3; 12 7.4,-1; 13 7.4,1; 14 7.4,3; 15 7.4,5; 16 7.4,7
ANT-SW868-TH13 = drill 1 pad 1.6: ANT 0,0
C0603 = smd 0.6 x 0.9: P$1 -0.75,0; P$2 0.75,0
SOD523 = smd 0.5 x 0.6: A 0.7,0; C -0.7,0
LED-PLCC-4-3522 = smd 1.5 x 1.1: 1 -1.5,0.75; 2 -1.5,-0.75; 3 1.5,-0.75; 4 1.5,0.75
L0603 = smd 0.6 x 0.9: P$1 -0.75,0; P$2 0.75,0
FIDUCIAL-1X2 = smd 1 x 1: 1 0,0
1X03 = drill 1.016 pad 1.88: 1 0,0; 2 2.54,0; 3 5.08,0
1X02 = drill 1.016 pad 1.88: 1 0,0; 2 2.54,0
HDR-1X4-254-SWD = drill 1 pad 1.7: 1 0,0; 2 2.54,0; 3 5.08,0; 4 7.62,0
HDR-1X5-254-ESP = drill 1 pad 1.7: 1 0,0; 2 2.54,0; 3 5.08,0; 4 7.62,0; 5 10.16,0
1X14 = drill 1 pad 1.7: 1 0,0; 2 2.54,0; 3 5.08,0; 4 7.62,0; 5 10.16,0; 6 12.7,0; 7 15.24,0; 8 17.78,0; 9 20.32,0; 10 22.86,0; 11 25.4,0; 12 27.94,0; 13 30.48,0; 14 33.02,0
SMT-JUMPER_2_NC_TRACE_OUTLINE = smd 0.635 x 1.27: 1 -0.508,0; 2 0.508,0
L2520_MM = smd 1.05 x 2.4: 1 -0.925,0; 2 0.925,0
BUZZER-4030_MM = smd 1.2 x 1.4: 1 -2.05,0 | smd 1.1 x 1.4: 2 2.05,0
SOT23-3 = smd 0.9 x 0.8: 1 -1,0.95; 2 -1,-0.95; 3 1,0
SC75-3 = smd 0.5 x 0.6: 1 -0.5,-0.65; 2 0.5,-0.65; 3 0,0.65
R0603 = smd 0.6 x 0.9: P$1 -0.75,0; P$2 0.75,0
SW-SMD-PTS815-4232 = smd 1 x 0.7: 1 -2.25,1.075; 2 2.25,1.075; 3 -2.25,-1.075; 4 2.25,-1.075
SW-SMD-PTS647-4545 = smd 1.55 x 1: 1 -2.625,1.6; 2 2.625,1.6; 3 -2.625,-1.6; 4 2.625,-1.6
SC70-6 = smd 0.35 x 0.85: 1 -0.65,-1.1; 2 0,-1.1; 3 0.65,-1.1; 4 0.65,1.1; 5 0,1.1; 6 -0.65,1.1
SOT363 = smd 0.4 x 0.8: 1 -0.65,-0.8; 2 0,-0.8; 3 0.65,-0.8; 4 0.65,0.8; 5 0,0.8; 6 -0.65,0.8
SOT23-5 = smd 0.55 x 1.2: 1 -0.95,-1.3; 2 0,-1.3; 3 0.95,-1.3; 4 0.95,1.3; 5 -0.95,1.3
VQFN32L-05-5050_MM-SEGMENTED = smd 1.2 x 0.26: 1 -2.7,1.75; 2 -2.7,1.25; 3 -2.7,0.75; 4 -2.7,0.25; 5 -2.7,-0.25; 6 -2.7,-0.75; 7 -2.7,-1.25; 8 -2.7,-1.75; 17 2.7,-1.75; 18 2.7,-1.25; 19 2.7,-0.75; 20 2.7,-0.25; 21 2.7,0.25; 22 2.7,0.75; 23 2.7,1.25; 24 2.7,1.75 | smd 0.26 x 1.2: 9 -1.75,-2.7; 10 -1.25,-2.7; 11 -0.75,-2.7; 12 -0.25,-2.7; 13 0.25,-2.7; 14 0.75,-2.7; 15 1.25,-2.7; 16 1.75,-2.7; 25 1.75,2.7; 26 1.25,2.7; 27 0.75,2.7; 28 0.25,2.7; 29 -0.25,2.7; 30 -0.75,2.7; 31 -1.25,2.7; 32 -1.75,2.7 | smd 3.5 x 3.5: 33 0,0
RFM95W = smd 1.95 x 1.05: 1 -7.4,7; 2 -7.4,5; 3 -7.4,3; 4 -7.4,1; 5 -7.4,-1; 6 -7.4,-3; 7 -7.4,-5; 8 -7.4,-7; 9 7.4,-7; 10 7.4,-5; 11 7.4,-3; 12 7.4,-1; 13 7.4,1; 14 7.4,3; 15 7.4,5; 16 7.4,7
SO8 = smd 1.55 x 0.6: 1 -2.7,1.905; 2 -2.7,0.635; 3 -2.7,-0.635; 4 -2.7,-1.905; 5 2.7,-1.905; 6 2.7,-0.635; 7 2.7,0.635; 8 2.7,1.905
LGA12 = smd 0.5 x 0.25: 1 -0.875,0.75; 2 -0.875,0.25; 3 -0.875,-0.25; 4 -0.875,-0.75; 7 0.875,-0.75; 8 0.875,-0.25; 9 0.875,0.25; 10 0.875,0.75 | smd 0.25 x 0.5: 5 -0.25,-0.875; 6 0.25,-0.875; 11 0.25,0.875; 12 -0.25,0.875
CHIPLED-PLCC4-2020MM = smd 0.65 x 0.8: 1 -0.675,0.6; 2 -0.675,-0.6; 3 0.675,-0.6; 4 0.675,0.6
BME280 = smd 0.35 x 0.5: 1 0.975,-1.025; 2 0.325,-1.025; 3 -0.325,-1.025; 4 -0.975,-1.025; 5 -0.975,1.025; 6 -0.325,1.025; 7 0.325,1.025; 8 0.975,1.025
WSON-6-NOPAD = smd 1 x 0.5: 1 -1.5,0.95; 2 -1.5,0; 3 -1.5,-0.95; 4 1.5,-0.95; 5 1.5,0; 6 1.5,0.95
CRYSTAL-3215 = smd 1 x 1.8: P$1 -1.25,0; P$2 1.25,0

### Placement (x,y rotation side)
A1  10,13 180 bottom
A2  28.5,9.5 270 top
AE1  41,10 0 top
C1  7.5,23 90 top
C2  5,24 180 top
C3  4.5,12 270 top
C4  6,12 270 top
C5  2,24 0 top
C6  9,23 90 top
C7  11.5,22.5 180 top
C8  1.5,28 90 top
C9  3,28 90 top
C10  8,27 90 top
C11  17,27 270 top
C12  18.5,27 270 top
C13  18,11 180 top
C14  18,9.5 180 top
C15  23,13 270 top
C16  2,14 0 top
C17  32,13 270 top
C18  29,7 270 top
D1  27,25.5 180 top
D2  27,24 180 top
D3  35,27 0 top
FB1  7.5,12 270 top
FD1  38,10.5 0 top
FD2  38,10.5 0 bottom
FD3  11,9.5 0 top
FD4  34,24.5 0 bottom
FD5  1.5,33.5 0 top
FD6  1.5,33.5 0 bottom
J1  13.97,30.5 0 top
J2  8.89,30.5 0 top
J3  34.29,30.5 0 top
J4  21.59,30.5 0 top
J5  8.89,33.5 0 top
JP1  29,13 270 top
JP2  2,8.5 0 top
L1  11,27 0 top
LS1  22.5,27 0 top
Q1  5.5,28 0 top
Q2  27,27.5 90 top
R1  2,19.5 180 top
R2  11.5,24 180 top
R3  14.98,21.46 0 top
R4  28,19.5 0 top
R5  2,12 0 top
R6  2,10.5 0 top
R7  18,17.5 180 top
R8  15,23 0 top
R9  18,16 0 top
R10  18,14.5 0 top
R11  9,12 270 top
R12  10.5,12 270 top
R13  8.5,9.5 0 top
R14  5.5,9.5 180 top
R15  30,25 0 top
R16  30,28 180 top
R17  30,26.5 180 top
S1  14,11 90 top
S2  22,21 0 top
U1  14.5,18 270 top
U2  14.5,15 270 top
U3  14.5,26.5 0 top
U4  8.5,17.5 0 top
U5  28.5,9.5 270 bottom
U6  34,21 0 top
U7  26,13 0 top
U8  2,17 0 top
U9  34.5,13 0 top
U10  26,7 0 top
U11  33,7 0 top
Y1  3,22 180 top

### Tracks (layer width: path | path; a pad name or v marks a point on that pad's centre or on a via)
3V3  (via drill 0.3)
  Top 0.2: U3.4 15.45,27.82 16.95,27.82 C11.P$1 C12.P$1 18.52,27.82 18.52,28.27 20.48,30.23 20.48,30.98 21.15,31.65 22.05,31.65 22.73,30.98 | D1.C 27.75,25.5 27.75,24.82 28.2,24.38 28.2,23.62 27.98,23.4 27.38,23.4 26.85,23.93 26.85,24.38 26.32,24.9 22.57,24.9 20.48,27 LS1.1 20.48,27.07 22.73,29.32 22.73,30.98 | v36.75,23.7 36.75,22.95 U6.8 | J5.14 41.85,33.45 40.95,33.45 39.15,31.65 38.02,31.65 36.9,30.52 J3.2 36.75,30.52 35.33,31.95 24,31.95 23.02,30.98 22.73,30.98 | U10.2 26.32,6.6 25.73,7.2 25.73,7.95 U10.6 25.73,8.03 25.73,8.25 26.02,8.55 26.62,8.55 26.93,8.25 26.93,8.03 U10.8 27,7.95 27.15,7.8 v27.6,7.8 28.95,7.8 C18.P$1 | 27.45,12.3 28.8,12.3 28.95,12.45 JP1.2 | 27.45,12.3 26.93,12.3 U7.7 | v27.45,11.78 27.45,12.3 | 26.48,0.82 22.8,0.82 21.52,2.1 A2.9 21.45,2.17 21.45,5.62 18.19,8.89 | 26.48,0.82 32.02,0.82 32.33,1.12 32.33,4.95 34.35,6.97 34.5,6.97 U11.5 | 26.48,0.82 v26.48,1.05 | 7.5,21.9 7.5,21.6 7.72,21.38 7.72,20.25 U4.30 | 7.5,21.9 C1.P$1 | 1.05,18.38 1.05,19.35 1.2,19.5 R1.P$2 | 1.05,18.38 1.05,18 U8.1 1.05,17.93 1.73,17.25 1.73,15.45 1.27,15 1.27,14.03 C16.P$1 | 7.5,21.9 6.75,21.9 v6.22,21.38 | 1.05,18.38 v3.45,18.38 | R9.P$2 R10.P$2 | C15.P$1 22.95,13.8 21.45,13.8 20.77,14.47 18.82,14.47 R10.P$2 | U7.3 25.35,12.75 26.25,13.65 U7.11 26.25,13.95 26.48,14.18 27.45,14.18 v27.6,14.03 | 15.9,11.7 15.9,9.75 16.61,9.04 | 15.9,11.7 15.9,13.72 15.3,14.32 U2.4 | 16.61,9.04 16.88,8.78 18.07,8.78 18.19,8.89 | 18.19,8.89 18.75,9.45 C14.P$1 C13.P$1 18.82,11.03 18.82,14.4 R10.P$2 | U1.3 13.57,17.18 13.65,17.18 v14.55,16.27 | 15.9,11.7 v15.68,11.7 | v16.5,18 U1.5 | FB1.P$2 7.5,11.03 7.12,10.65 7.12,9 8.47,7.65 15.22,7.65 16.61,9.04
  Top 0.2: v15.75,19.43 15.75,21.45 R3.P$2
  Route2 0.2: v36.75,23.7 29.02,15.97 29.02,15.45 v27.6,14.03
  Route15 0.2: v27.6,14.03 24.6,14.03 22.27,11.7 v15.68,11.7 14.93,11.7 14.03,12.6 9.68,12.6 3.9,18.38 v3.45,18.38
  Bottom 0.2: v36.75,23.7 36.75,30.38 36.83,30.45 J3.2 | 27.45,7.8 27.45,2.1 U5.13 27.45,2.02 v26.48,1.05 | 27.45,7.8 v27.45,11.78 | v27.6,7.8 27.45,7.8 | v6.22,21.38 6.22,21.15 v3.45,18.38 | v14.55,16.27 14.55,13.57 14.7,13.43 14.7,12.68 14.55,12.53 14.55,12.07 14.93,11.7 v15.68,11.7 15.75,11.7 15.75,15.75 16.5,16.5 v16.5,18 16.43,18 15.75,18.68 v15.75,19.43
*ESP_RST
  Bottom 0.15: A1.4 0.75,14.25 0.75,10.88 1.95,9.68 1.95,9.53 A1.1
AIN_BAT  (via drill 0.3)
  Top 0.15: R2.P$1 12.3,24 12.3,22.5 C7.P$1 12.22,22.5 12.15,22.43 v12.15,21.6 | U4.5 4.95,17.25 v4.35,16.65
  Route2 0.15: v4.35,16.65 5.62,16.65 10.57,21.6 v12.15,21.6
ANT
  Bottom 0.2: U5.9 35.55,2.1 35.55,4.58 40.95,9.97 AE1.ANT
BOOST_SW
  Top 0.2: L1.2 13.5,25.43 13.5,25.2 U3.1
BUTTON*  (via drill 0.3)
  Top 0.15: S2.3 19.43,19.43 24.6,19.43 S2.4 | v6.15,13.65 5.4,13.65 4.65,14.4 4.65,16.12 5.25,16.73 5.78,16.73 U4.6 | v27.82,15.07 27.82,16.57 A2.5 25.05,19.35 24.68,19.35 S2.4 | v25.8,21.07 25.8,20.02 25.12,19.35 S2.4
  Route2 0.15: v25.8,21.07 26.85,22.12 26.85,22.73 32.77,28.65 32.77,30.38 34.27,31.88 34.27,33.45 J5.11
  Route15 0.15: v6.15,13.65 6.3,13.65 8.55,11.4 14.7,11.4 14.93,11.18 22.95,11.18 25.27,13.5 27.82,13.5 28.12,13.8 28.12,14.78 v27.82,15.07
BUZZER  (via drill 0.3)
  Top 0.15: v27.6,26.25 27.6,27 Q2.1 | v12.07,13.5 11.55,13.5 U4.16
  Route2 0.15: v27.6,26.25 20.55,19.2 18.52,19.2 12.82,13.5 v12.07,13.5
CG
  Top 0.15: R17.P$1 30.75,26.48 32.25,24.98 32.25,24.9 32.55,24.6 34.8,24.6 36.45,26.25 D3.3
CR
  Top 0.15: R16.P$1 30.75,27.98 33.23,27.98 33.45,27.75 D3.1
DRIVE  (via drill 0.3)
  Top 0.15: R4.P$2 28.95,19.5 31.43,17.02 | 31.43,17.02 31.5,16.95 A2.3 31.43,17.02 | v4.72,18.38 4.8,18.3 5.78,18.3 U4.3 | 31.43,17.02 v29.4,15
  Route2 0.15: v26.85,11.18 26.85,12.9 27.45,13.5 27.9,13.5 v29.4,15
  Route15 0.15: v29.4,15 33.3,18.9 33.3,24.98 37.88,29.55 37.88,30.45 39.3,31.88 39.3,33.45 J5.13
  Bottom 0.15: v4.72,18.38 4.72,17.48 13.43,8.78 13.43,8.4 13.72,8.1 23.77,8.1 v26.85,11.18
EN_WIFI  (via drill 0.3)
  Top 0.15: v13.65,19.27 13.43,19.05 13.43,18.68 U1.1 | v14.7,17.48 15.53,17.48 15.6,17.4 U1.4 | U4.15 9.75,14.32 10.12,13.95 10.35,13.95 v10.57,13.72 11.78,12.53 13.35,12.53 13.5,12.68 13.5,13.35 13.88,13.72 14.03,13.72 14.32,14.03 14.32,14.93 15,15.6 15.3,15.6 U2.6
  Bottom 0.15: v13.65,19.27 13.65,18.52 14.14,18.04 | v14.7,17.48 14.14,18.04 | 14.14,18.04 12.68,16.57 12.6,16.57 10.57,14.55 v10.57,13.72
ESP_EN  (via drill 0.3)
  Top 0.15: R5.P$2 3.3,12 v3.52,11.78
  Route15 0.15: v3.52,11.78 3.52,11.4 4.05,10.88 4.05,10.43 3.75,10.12 3.3,10.12 2.62,10.8 2.62,24.75 3.67,25.8 5.47,25.8 v8.18,28.5
  Bottom 0.15: v3.52,11.78 3.52,12 2.02,13.5 A1.3 | v8.18,28.5 11.1,28.5 12.75,30.15 12.75,30.98 13.8,32.02 28.65,32.02 29.1,31.57 30.68,31.57 J4.5
ESP_G0  (via drill 0.3)
  Top 0.15: R6.P$2 3.38,10.5 v3.52,10.65
  Route2 0.15: v16.5,14.4 18.75,14.4 23.02,18.68 23.02,19.8 29.18,25.95 29.18,30.45 J4.4
  Route15 0.15: v3.52,10.65 3.52,10.95 2.92,11.55 2.92,18.6 3.23,18.9 7.2,18.9 12.07,14.03 12.3,14.03 12.6,13.72 15.82,13.72 v16.5,14.4
  Bottom 0.15: v16.5,14.4 16.5,15.97 18,17.48 A1.12
ESP_G5  (via drill 0.3)
  Top 0.15: 16.57,18.6 16.65,18.6 17.25,18 R7.P$2 | 16.57,18.6 15.6,18.6 U1.6 | v16.57,18.75 16.57,18.6
  Bottom 0.15: v16.57,18.75 16.88,18.75 17.25,18.38 18.98,18.38 19.27,18.07 19.27,14.78 A1.14
ESP_G15  (via drill 0.3)
  Top 0.15: v16.5,22.95 15.75,22.95 R8.P$2
  Bottom 0.15: v16.5,22.95 18,21.45 A1.10
ESP_RX  (via drill 0.3)
  Top 0.15: v26.32,22.35 26.32,24 D2.A | R11.P$2 9.45,11.25 10.2,12 v12.22,12
  Route2 0.15: v12.22,12 14.62,12 15.45,11.18 18.9,11.18 v20.7,12.97
  Route15 0.15: v26.32,22.35 26.32,15.97 24.75,14.4 24.45,14.4 23.02,12.97 v20.7,12.97
  Bottom 0.15: v20.7,12.97 19.8,12.97 18.38,11.55 18,11.55 A1.15
ESP_RX_CON
  Top 0.15: D2.C 27.68,24 27.68,24.38 26.93,25.12 26.93,28.35 26.7,28.57 26.7,30.45 J4.3
ESP_TX  (via drill 0.3)
  Top 0.15: R12.P$2 12.15,11.25 v12.53,10.88 | v33.83,22.95 32.85,23.93 31.73,23.93 31.27,24.38 31.27,24.45 30.75,24.98 R15.P$2
  Route2 0.15: v33.83,22.95 33.3,22.95 20.02,9.68 13.72,9.68 v12.53,10.88
  Bottom 0.15: v12.53,10.88 12.97,10.88 14.32,9.53 18,9.53 A1.16
ESP_TX_CON
  Top 0.15: R15.P$1 29.25,25.43 28.2,26.48 28.2,29.93 27.75,30.38 27.75,30.98 27.15,31.57 25.2,31.57 24.15,30.52 J4.2
EXT_RX  (via drill 0.3)
  Top 0.15: v13.95,8.62 13.35,8.03 10.95,8.03 9.53,9.45 9.3,9.45 R13.P$2 8.32,10.43 8.32,11.47 7.88,11.93 v6.83,11.93 | A2.14 v28.57,5.03
  Route2 0.15: v6.83,11.93 6.83,14.4 15,22.57 15,30.45 16.5,31.95 16.5,33.45 J5.4
  Bottom 0.15: v13.95,8.62 23.55,8.62 27.23,12.3 27.68,12.3 28.57,11.4 v28.57,5.03
EXT_SS  (via drill 0.3)
  Top 0.15: v12.9,19.27 11.93,18.3 11.25,18.3 U4.22 | A2.13 29.32,2.1 26.32,5.1 24.6,5.1 23.77,5.92 23.77,7.05 21.23,9.6 21.23,13.2 v20.7,13.72
  Route2 0.15: v20.7,13.72 19.8,12.82 14.47,12.82 14.32,12.68 12.15,12.68 11.55,13.28 11.55,17.93 v12.9,19.27
  Route15 0.15: v12.9,19.27 12.9,19.73 12.82,19.8 12.82,25.35 18,30.52 18,32.4 19.05,33.45 J5.5
EXT_TX  (via drill 0.3)
  Top 0.15: v4.72,10.5 4.72,9.53 R14.P$2 | v34.05,3.52 33.52,3 33.52,2.1 A2.15
  Route2 0.15: v4.72,10.5 4.72,15.53 3.83,16.43 3.83,18 4.2,18.38 4.2,21.82 12.97,30.6 12.97,32.48 13.95,33.45 J5.3
  Route15 0.15: v34.05,3.52 23.48,3.52 17.55,9.45 5.78,9.45 v4.72,10.5
GND  (via drill 0.3)
  Top 0.2: U8.3 3,16.95 2.77,16.73 2.77,14.03 C16.P$2 2.77,13.95 2.77,13.35 4.5,11.62 C3.P$2 C4.P$2 6,11.03 v6.53,10.5 | v35.48,21.6 36.67,21.6 U6.7 | U2.2 13.43,15 12.97,14.55 12.97,14.25 | 12.97,14.25 12.97,13.28 S1.2 | 26.93,12.9 26.93,13.2 U7.9 | 26.93,12.9 26.93,12.75 U7.8 | v27.6,12.9 26.93,12.9 | v14.4,10.2 12.97,8.78 S1.1 | v12.82,14.25 12.97,14.25 | 25.05,8.93 25.05,12.15 25.12,12.22 U7.4 | 25.05,8.93 25.05,8.03 U10.5 | U9.2 33.83,12.38 32.1,12.38 32.02,12.3 C17.P$2 31.95,12.22 31.95,9.53 31.54,9.11 | U10.1 27,6 28.73,6 28.95,6.22 C18.P$2 29.02,6.3 29.7,6.97 30.75,6.97 | U10.7 26.32,7.12 27,6.45 27,6.08 U10.1 | 30.75,6.97 31.5,6.97 U11.2 | 30.75,8.32 31.54,9.11 | 30.75,6.97 30.75,8.32 | 25.05,8.93 30.07,8.93 30.68,8.32 30.75,8.32 | 24.45,13.72 25.12,13.72 U7.1 | 24.45,13.72 23.02,12.3 C15.P$2 23.02,12.22 23.02,8.32 24.15,7.2 24.15,6.08 24.75,5.47 26.62,5.47 26.93,5.78 26.93,5.92 U10.1 | 24.45,13.72 24.45,13.8 21.52,16.73 21.52,16.88 A2.8 21.45,16.95 19.27,16.95 18.82,17.4 R7.P$1 18.75,17.4 18.15,16.8 18.15,15.82 17.62,15.3 | C14.P$2 C13.P$2 17.32,11.03 17.32,13.5 17.85,14.03 17.85,15 17.62,15.22 17.62,15.3 | 15.97,15 16.65,15 16.95,15.3 17.62,15.3 | 15.97,15 U2.5 | 15.97,15 15.97,15.9 15,16.88 14.47,16.88 14.1,17.25 14.1,17.62 13.72,18 U1.2 13.8,18 14.85,19.05 14.85,22.43 14.32,22.95 R8.P$1 14.25,24.9 14.47,25.12 U3.2 14.55,25.27 14.55,25.5 15.22,26.18 | 8.93,31.73 8.93,30.52 J2.1 8.85,30.45 7.8,30.45 5.36,28.01 | 8.93,31.73 8.93,33.45 J5.1 | U4.10 7.28,14.85 7.28,16.27 U4.33 8.7,17.7 8.7,20.18 U4.28 8.78,20.25 8.78,20.93 10.28,22.43 10.28,22.5 | C8.P$2 1.5,28.8 3,28.8 C9.P$2 3.08,28.8 3.23,28.95 Q1.1 4.5,28.88 5.36,28.01
  Top 0.2: C5.P$2 C2.P$2 4.28,24.07 4.72,24.07 5.4,24.75 7.28,24.75 | 10.28,22.5 10.2,22.5 9,23.7 C6.P$2 8.93,23.77 7.5,23.77 C1.P$2 7.5,23.85 7.28,24.07 7.28,24.75 | 10.28,22.5 C7.P$2 | 7.28,27.07 7.95,27.75 C10.P$2 | 7.28,24.75 7.28,27.07 | 5.36,28.01 5.78,27.6 5.78,27.52 6.22,27.07 7.28,27.07 | J3.1 34.27,30.45 33.23,29.4 30.6,29.4 29.85,28.65 29.85,28.57 29.32,28.05 R16.P$2 R17.P$2 29.32,26.48 29.85,25.95 29.85,21.75 | 29.85,21.75 29.85,20.4 31.12,19.12 31.27,19.12 U6.4 | v27.3,28.73 27.6,28.43 27.6,28.05 Q2.2 | C12.P$2 C11.P$2 16.95,26.18 15.22,26.18 | 19.35,23.55 19.35,25.35 18.52,26.18 C12.P$2 | 19.35,23.55 19.35,22.65 S2.1 19.43,22.57 24.6,22.57 S2.2 24.68,22.57 25.5,21.75 29.85,21.75 | v19.5,23.55 19.35,23.55 | 15.22,26.18 15.22,26.25 14.93,26.55 14.93,27.68 14.03,28.57 14.03,30.45 J1.1 13.88,30.52 12.68,31.73 8.93,31.73 | J4.1 21.52,30.45 21.52,29.7 18.52,26.7 18.52,26.32 C12.P$2 | v31.5,9.15 31.54,9.11
  Route15 0.2: v6.53,10.5 6.83,10.5 7.5,9.82 14.03,9.82 v14.4,10.2
  Bottom 0.2: v35.48,21.6 35.48,16.95 U5.8 35.48,16.88 35.48,9.07 33.52,7.12 33.45,7.12 | 21.52,12.9 23.85,10.57 24.38,10.57 26.7,12.9 v27.6,12.9 27.68,12.9 31.46,9.11 | 21.52,12.9 21.52,16.88 A2.8 | 21.52,12.9 21.45,12.9 19.2,10.65 17.25,10.65 16.8,10.2 v14.4,10.2 14.4,10.28 12.82,11.85 v12.82,14.25 | 33.45,7.12 33.45,2.1 U5.10 | 31.46,9.11 33.45,7.12 | v27.3,28.73 23.32,28.73 21.6,30.45 J4.1 | v19.5,23.55 18,23.55 A1.9 | v31.5,9.15 31.46,9.11
LED_G  (via drill 0.3)
  Top 0.15: v13.43,28.95 11.4,28.95 10.88,28.43 10.88,25.57 11.32,25.12 11.32,22.05 11.1,21.82 10.35,21.82 9.3,20.77 9.3,20.25 U4.27 | v31.5,26.62 33.08,26.62 33.45,26.25 D3.2 33.38,26.25 32.77,25.65 v32.77,25.12 | v32.77,20.55 33.45,19.88 33.45,16.95 A2.2
  Bottom 0.15: v13.43,28.95 14.1,28.95 15.3,30.15 15.3,30.98 16.05,31.73 27,31.73 28.12,30.6 28.12,30 v31.5,26.62 | v32.77,25.12 v32.77,20.55
LED_R  (via drill 0.3)
  Top 0.15: v11.55,21.07 10.72,20.25 10.28,20.25 U4.25 | D3.4 36.45,27.75 36.38,27.82 v34.73,27.82 34.73,28.12 34.12,28.73 30.45,28.73 30.23,28.5 30.23,24.45 31.05,23.62 31.95,23.62 33.3,22.27 33.3,20.62 35.48,18.45 35.48,16.95 A2.1
  Bottom 0.15: v11.55,21.07 13.72,21.07 18.38,25.73 32.17,25.73 34.27,27.82 v34.73,27.82
LORA_D0  (via drill 0.3)
  Top 0.15: v7.72,13.72 7.72,14.78 U4.11
  Bottom 0.15: v7.72,13.72 13.12,8.32 13.12,8.25 13.72,7.65 19.95,7.65 U5.14
LORA_D1  (via drill 0.3)
  Top 0.15: U4.12 8.25,12.45 v8.7,12
  Route2 0.15: v8.7,12 9,12 13.35,7.65 18.98,7.65 19.88,6.75 v19.88,6.38
  Bottom 0.15: v19.88,6.38 19.88,5.7 23.48,2.1 U5.15
LORA_RST  (via drill 0.3)
  Top 0.15: v5.85,15.15 5.85,15.75 U4.8 | v9.68,10.57 12.07,10.57 12.3,10.35 12.75,10.35 14.1,11.7 v14.1,13.2
  Route2 0.15: v14.1,13.2 14.55,13.2 20.25,18.9 v22.5,18.9
  Bottom 0.15: v5.85,15.15 5.85,14.7 8.18,12.38 8.18,11.78 9.38,10.57 v9.68,10.57 | v22.5,18.9 29.55,18.9 31.5,16.95 U5.6
LORA_SS  (via drill 0.3)
  Top 0.15: v5.55,14.25 4.95,14.85 4.95,15.9 5.25,16.2 5.78,16.2 U4.7
  Route15 0.15: v5.55,14.25 5.55,13.5 6.6,12.45 7.05,12.45 8.4,11.1 11.55,11.1 12.3,10.35 13.8,10.35 14.18,10.72 18.6,10.72 25.43,3.9 26.48,3.9 30.15,7.58 v30.15,12.97
  Bottom 0.15: v30.15,12.97 30.15,16.27 29.55,16.88 U5.5
LTR_3V3
  Top 0.2: U9.1 33.83,13.65 32.1,13.65 C17.P$1 31.95,13.72 31.8,13.57 29.02,13.57 JP1.1
MCLK  (via drill 0.3)
  Top 0.15: v25.5,4.58 A2.11 | v12.53,17.25 U4.20
  Route15 0.15: v25.5,4.58 25.5,8.1 28.43,11.03 v28.43,15.68 28.43,20.48 26.85,22.05 26.85,22.57 20.96,28.46 | v12.53,17.25 12.82,17.25 18.98,23.4 18.98,26.48 20.96,28.46 | 20.96,28.46 23.1,30.6 23.1,32.48 24.07,33.45 J5.7
  Bottom 0.15: v28.43,15.68 28.43,15.97 U5.4
MISO  (via drill 0.3)
  Top 0.15: v12.53,18 12.3,17.77 11.25,17.77 U4.21 | v26.25,4.42 27.45,3.23 27.45,2.1 A2.12
  Route2 0.15: v20.62,20.02 17.1,20.02 15.07,18 v12.53,18 | v26.25,4.42 26.25,9.15 25.88,9.53 25.88,14.78 v26.18,15.07
  Route15 0.15: v12.53,18 13.12,18 18.68,23.55 18.68,28.73 20.55,30.6 20.55,32.48 21.52,33.45 J5.6
  Bottom 0.15: v20.62,20.02 23.48,17.18 23.48,16.95 U5.2 23.48,17.25 24.38,18.15 26.02,18.15 26.25,17.93 26.25,15.9 26.18,15.82 v26.18,15.07
MOSI  (via drill 0.3)
  Top 0.15: v12.82,16.05 12.15,16.73 11.25,16.73 U4.19 | v19.73,13.5 19.73,10.65 23.48,6.9 23.48,2.1 A2.10
  Route2 0.15: v32.25,27.15 32.25,26.02 v19.73,13.5
  Bottom 0.15: v12.82,16.05 12.82,15 13.57,14.25 13.57,12.53 14.93,11.18 15.9,11.18 16.73,12 16.73,12.07 17.32,12.68 19.05,12.68 19.84,13.46 | 19.84,13.46 20.18,13.8 20.18,17.32 21,18.15 22.05,18.15 22.73,17.48 22.73,15.9 22.95,15.68 24.3,15.68 25.5,16.88 U5.3 | v19.73,13.5 19.8,13.5 19.84,13.46 | v32.25,27.15 32.85,27.75 32.85,30.98 31.95,31.88 29.25,31.88 27.68,33.45 26.7,33.45 J5.8
N$1
  Top 0.15: 26.32,27 26.32,27.45 Q2.3 | 26.32,27 26.32,25.5 D1.A | LS1.2 26.32,27
N$2
  Top 0.15: U8.2 0.97,16.05 0.97,15.22 0.68,14.93 0.68,9.3 1.43,8.55 JP2.1
RESET  (via drill 0.3)
  Top 0.15: S1.4 15.07,12.3 | 15.07,12.3 S1.3 | v3.45,20.18 2.77,19.5 R1.P$1 | U4.26 9.75,20.7 10.12,21.07 v10.8,21.07 | v34.5,10.05 35.48,9.07 35.48,2.1 A2.16 | v15.15,12.3 15.07,12.3
  Bottom 0.15: 3.45,21.9 3.45,24.07 3.9,24.52 3.9,27.23 9.07,32.4 10.35,32.4 11.4,33.45 J5.2 | 3.45,21.9 v3.45,20.18 | 3.45,21.9 8.32,21.9 9.15,21.07 v10.8,21.07 11.32,20.55 15.22,20.55 | v34.5,10.05 34.5,14.1 32.25,16.35 32.25,17.93 29.62,20.55 15.22,20.55 | v15.15,12.3 15.15,17.18 15.22,17.25 15.22,20.55
RX1
  Top 0.15: R12.P$1 10.5,13.05 9.3,14.25 9.3,14.78 U4.14
SCL  (via drill 0.3)
  Top 0.15: 35.17,14.47 35.17,14.78 36.3,15.9 36.3,18.07 35.7,18.68 35.7,19.5 36.52,20.32 36.67,20.32 U6.6 36.23,20.1 34.95,21.38 34.95,22.57 33.3,24.23 32.48,24.23 32.1,24.6 v31.8,24.6 | 35.17,14.47 U9.4 | v24.07,11.18 24.07,7.8 24.98,6.9 24.98,6 U10.4 | R9.P$1 17.25,16.43 18.23,17.4 18.23,18 18.45,18.23 22.2,18.23 23.48,16.95 A2.7 23.55,16.88 23.93,16.5 v23.93,15.15 24.45,15.15 25.73,13.88 U7.12 25.65,14.03 26.18,14.55 27.82,14.55 27.9,14.47 35.17,14.47 | v33.52,7.95 U11.6 | v12.3,15.45 12.3,15.68 11.78,16.2 11.25,16.2 U4.18
  Route15 0.15: v31.8,24.6 30.75,25.65 30.75,30.38 29.25,31.88 29.25,33.45 J5.9 | v12.3,15.45 23.62,15.45 v23.93,15.15
  Bottom 0.15: 24.07,11.4 24.07,11.55 23.93,11.7 v23.93,15.15 | v33.52,7.95 28.05,13.43 26.7,13.43 24.68,11.4 24.07,11.4 | 24.07,11.4 v24.07,11.18
SDA  (via drill 0.3)
  Top 0.15: v16.5,13.65 17.02,14.18 17.02,14.25 17.25,14.47 R10.P$1 | v12.15,14.7 12.15,14.85 11.25,15.75 U4.17 | 24.6,11.93 24.6,7.72 25.65,6.67 25.65,6 U10.3 | 24.6,11.93 24.6,12.9 24.9,13.2 25.12,13.2 U7.2 | A2.6 25.5,15.9 v25.05,15.45 | 24.6,11.93 v24.45,11.93 | U11.1 32.96,9.41 | 32.96,9.41 35.17,11.62 U9.3 35.17,12.45 36.67,13.95 36.67,18.3 | 36.67,18.3 36.67,19.05 U6.5 | 36.67,18.3 v36.83,18.3 | 32.96,9.41 v32.55,9.82
  Route15 0.15: v16.5,13.65 17.02,14.18 17.02,14.62 | 17.02,14.62 16.73,14.93 12.38,14.93 v12.15,14.7 | 17.02,14.62 24.23,14.62 v25.05,15.45
  Bottom 0.15: 25.05,14.55 25.05,12.53 v24.45,11.93 | 25.05,14.55 v25.05,15.45 | v36.83,18.3 36.83,21 35.7,22.12 35.7,30.68 34.8,31.57 34.2,31.57 32.33,33.45 31.8,33.45 J5.10 | 25.05,14.55 27.82,14.55 v32.55,9.82
SENSE  (via drill 0.3)
  Top 0.15: 27.3,19.5 27.3,19.12 29.48,16.95 A2.4 | v5.25,26.32 4.88,25.95 2.17,25.95 0.68,24.45 0.68,21.38 1.8,20.25 1.8,19.43 2.4,18.82 3.15,18.82 3.23,18.9 3.67,18.9 3.98,18.6 3.98,18.38 4.58,17.77 5.78,17.77 U4.4 | v16.73,28.5 16.73,29.02 17.85,30.15 17.85,30.98 19.27,32.4 30.82,32.4 | 30.82,32.4 35.77,32.4 36.83,33.45 J5.12 | 27.3,19.5 27.3,19.95 v28.5,21.15 | 30.82,32.4 v30.82,32.55 | 27.3,19.5 R4.P$1
  Bottom 0.15: v5.25,26.32 14.55,26.32 v16.73,28.5 | v28.5,21.15 28.5,22.05 31.88,25.43 32.33,25.43 34.2,27.3 34.95,27.3 35.25,27.6 35.25,28.05 33.9,29.4 33.83,29.4 33.15,30.07 33.15,31.12 31.88,32.4 30.98,32.4 v30.82,32.55
SWCLK/TX3  (via drill 0.3)
  Top 0.15: v7.72,10.43 7.72,9.53 R13.P$1 | v13.35,20.02 13.35,20.62 14.18,21.45 R3.P$1 | v6.97,21.3 7.2,21.07 7.2,20.25 U4.31
  Route2 0.15: v7.72,10.43 7.72,12.97 11.25,16.5 11.25,18.38 12.9,20.02 v13.35,20.02 15.07,20.02 25.12,30.07 25.12,30.38 26.25,31.5 31.2,31.5 33.08,33.38 v33.08,34.12
  Bottom 0.15: v6.97,21.3 8.47,21.3 9.75,20.02 v13.35,20.02 | v33.08,34.12 33.08,33.15 33.83,32.4 39,32.4 40.88,30.52 41.85,30.52 J3.4
SWDIO/RX3  (via drill 0.3)
  Top 0.15: 5.74,9.41 4.88,8.55 2.55,8.55 JP2.2 | 5.74,9.41 5.78,9.45 6.22,9.45 R14.P$1 | v6.15,20.18 6.75,20.18 U4.32 | v5.47,10.5 5.47,9.68 5.74,9.41
  Route2 0.15: v5.47,10.5 6.08,9.9 7.95,9.9 8.25,10.2 8.25,10.65 8.18,10.72 8.18,12.22 8.47,12.53 8.93,12.53 9.97,11.47 12.68,11.47 13.28,10.88 19.35,10.88 21.23,12.75 21.23,13.2 23.7,15.68 24.07,15.68 33.3,24.9 33.3,24.98 38.77,30.45 39.3,30.45 J3.3
  Bottom 0.15: v6.15,20.18 5.78,20.18 4.2,18.6 4.2,17.55 5.03,16.73 5.03,10.95 v5.47,10.5
TX1
  Top 0.15: R11.P$1 9,14.03 8.78,14.25 8.78,14.78 U4.13
USB_DM  (via drill 0.3)
  Top 0.15: U4.23 11.7,18.75 12.38,19.43 12.38,20.62 13.35,21.6 v13.35,21.68
  Bottom 0.15: v13.35,21.68 13.8,21.68 19.05,26.93 J1.3
USB_DP  (via drill 0.3)
  Top 0.15: v12.82,28.43 11.32,28.43 11.18,28.27 11.18,25.73 11.32,25.57 11.7,25.57 12.82,24.45 12.82,21.52 11.25,19.95 11.25,19.27 U4.24
  Bottom 0.15: v12.82,28.43 14.47,28.43 16.5,30.45 J1.2
VAUX  (via drill 0.3)
  Top 0.2: C8.P$1 1.5,27.3 3,27.3 C9.P$1 3.08,27.23 v3.08,26.48 | R6.P$1 1.27,10.5 1.27,12 R5.P$1 1.27,12.07 1.27,12.9 2.17,13.8 2.17,17.32 2.55,17.7 3.45,17.7 3.75,17.4 3.75,16.35 v3.45,16.05 | v13.43,16.57 13.65,16.35 13.65,15.68 U2.1
  Route15 0.2: v13.43,16.57 13.12,16.57 13.05,16.65 12.3,16.65 7.58,21.38 7.58,21.52 4.35,24.75 v3.38,24.75
  Bottom 0.2: v3.45,16.05 2.85,16.65 0.97,16.65 0.75,16.88 0.75,22.27 1.95,23.48 A1.8 2.02,23.55 3.23,24.75 v3.38,24.75 3.23,24.82 3.08,24.98 v3.08,26.48
VBAT  (via drill 0.3)
  Top 0.2: R2.P$2 10.72,24 10.72,25.2 10.12,25.8 10.12,27 L1.1 10.05,26.25 C10.P$1 8.03,26.32 v8.03,27 | v5.4,27.07 4.5,27.07 Q1.2
  Bottom 0.2: v5.4,27.07 7.95,27.07 v8.03,27
VDDANA
  Top 0.2: C3.P$1 C4.P$1 6.75,12.75 | 6.75,12.75 FB1.P$1 | 6.75,12.75 U4.9
VDDCORE
  Top 0.2: C6.P$1 9,21.68 8.25,20.93 U4.29
VIN
  Top 0.2: Q1.3 6.53,28.05 6.9,28.05 8.1,29.25 10.2,29.25 11.4,30.45 J2.2
XI32
  Top 0.2: C2.P$1 5.7,24 5.7,23.48 4.28,22.05 Y1.P$1 4.28,21.98 4.28,21.23 5.78,19.73 5.78,19.27 U4.1
XO32
  Top 0.2: C5.P$1 1.27,24 1.27,22.5 1.73,22.05 Y1.P$2 1.8,21.98 1.8,21.45 2.25,21 3.45,21 4.05,20.4 4.05,19.95 5.25,18.75 U4.2

### Text on the board
tPlace: HALL
bPlace: TTN Madrid Node v7.1